# EasyEDA schematic SCH_ZIF CONNECTOR_2023-04-06.json

## Sheets
1 Sheet_1: TITLE: Sheet_1; REV: 1.0; Date: 2023-02-28; Sheet: 1/1; Drawn By: venkatakrishnanr; Company: Your Company
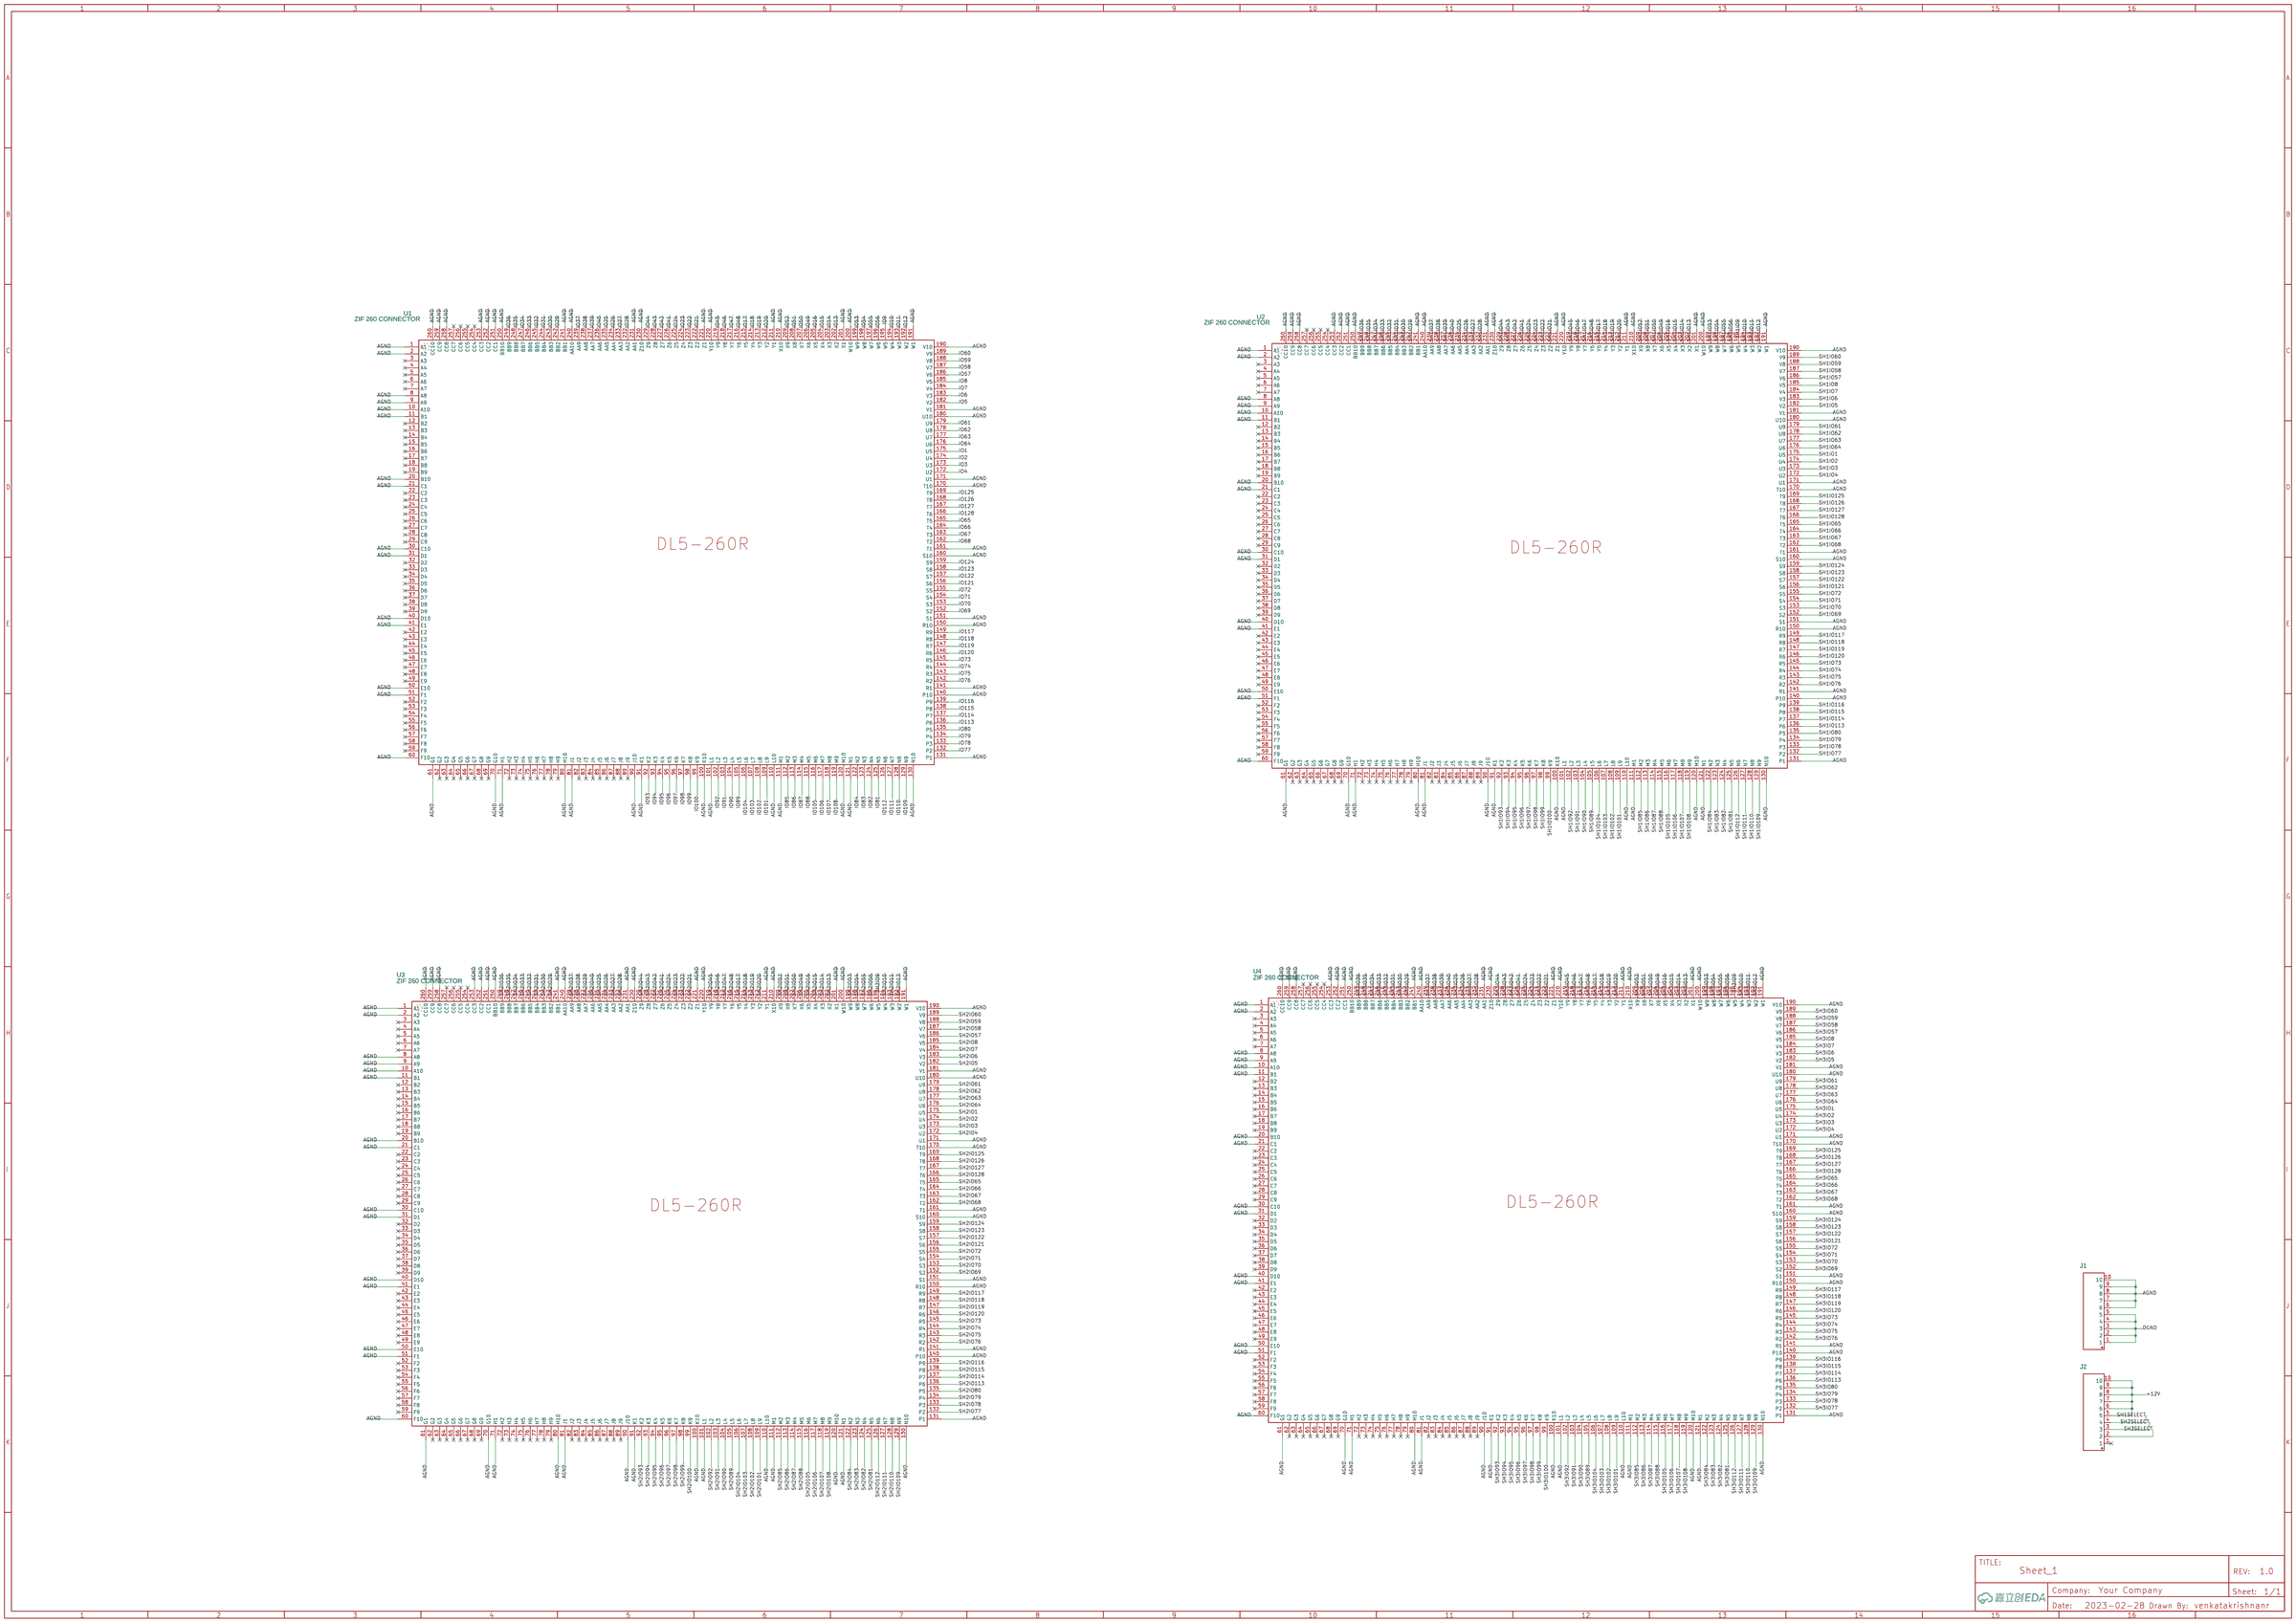
[diagram p0: Sheet_1]
2 Sheet_2: TITLE: Sheet_2; Date: 2023-03-07
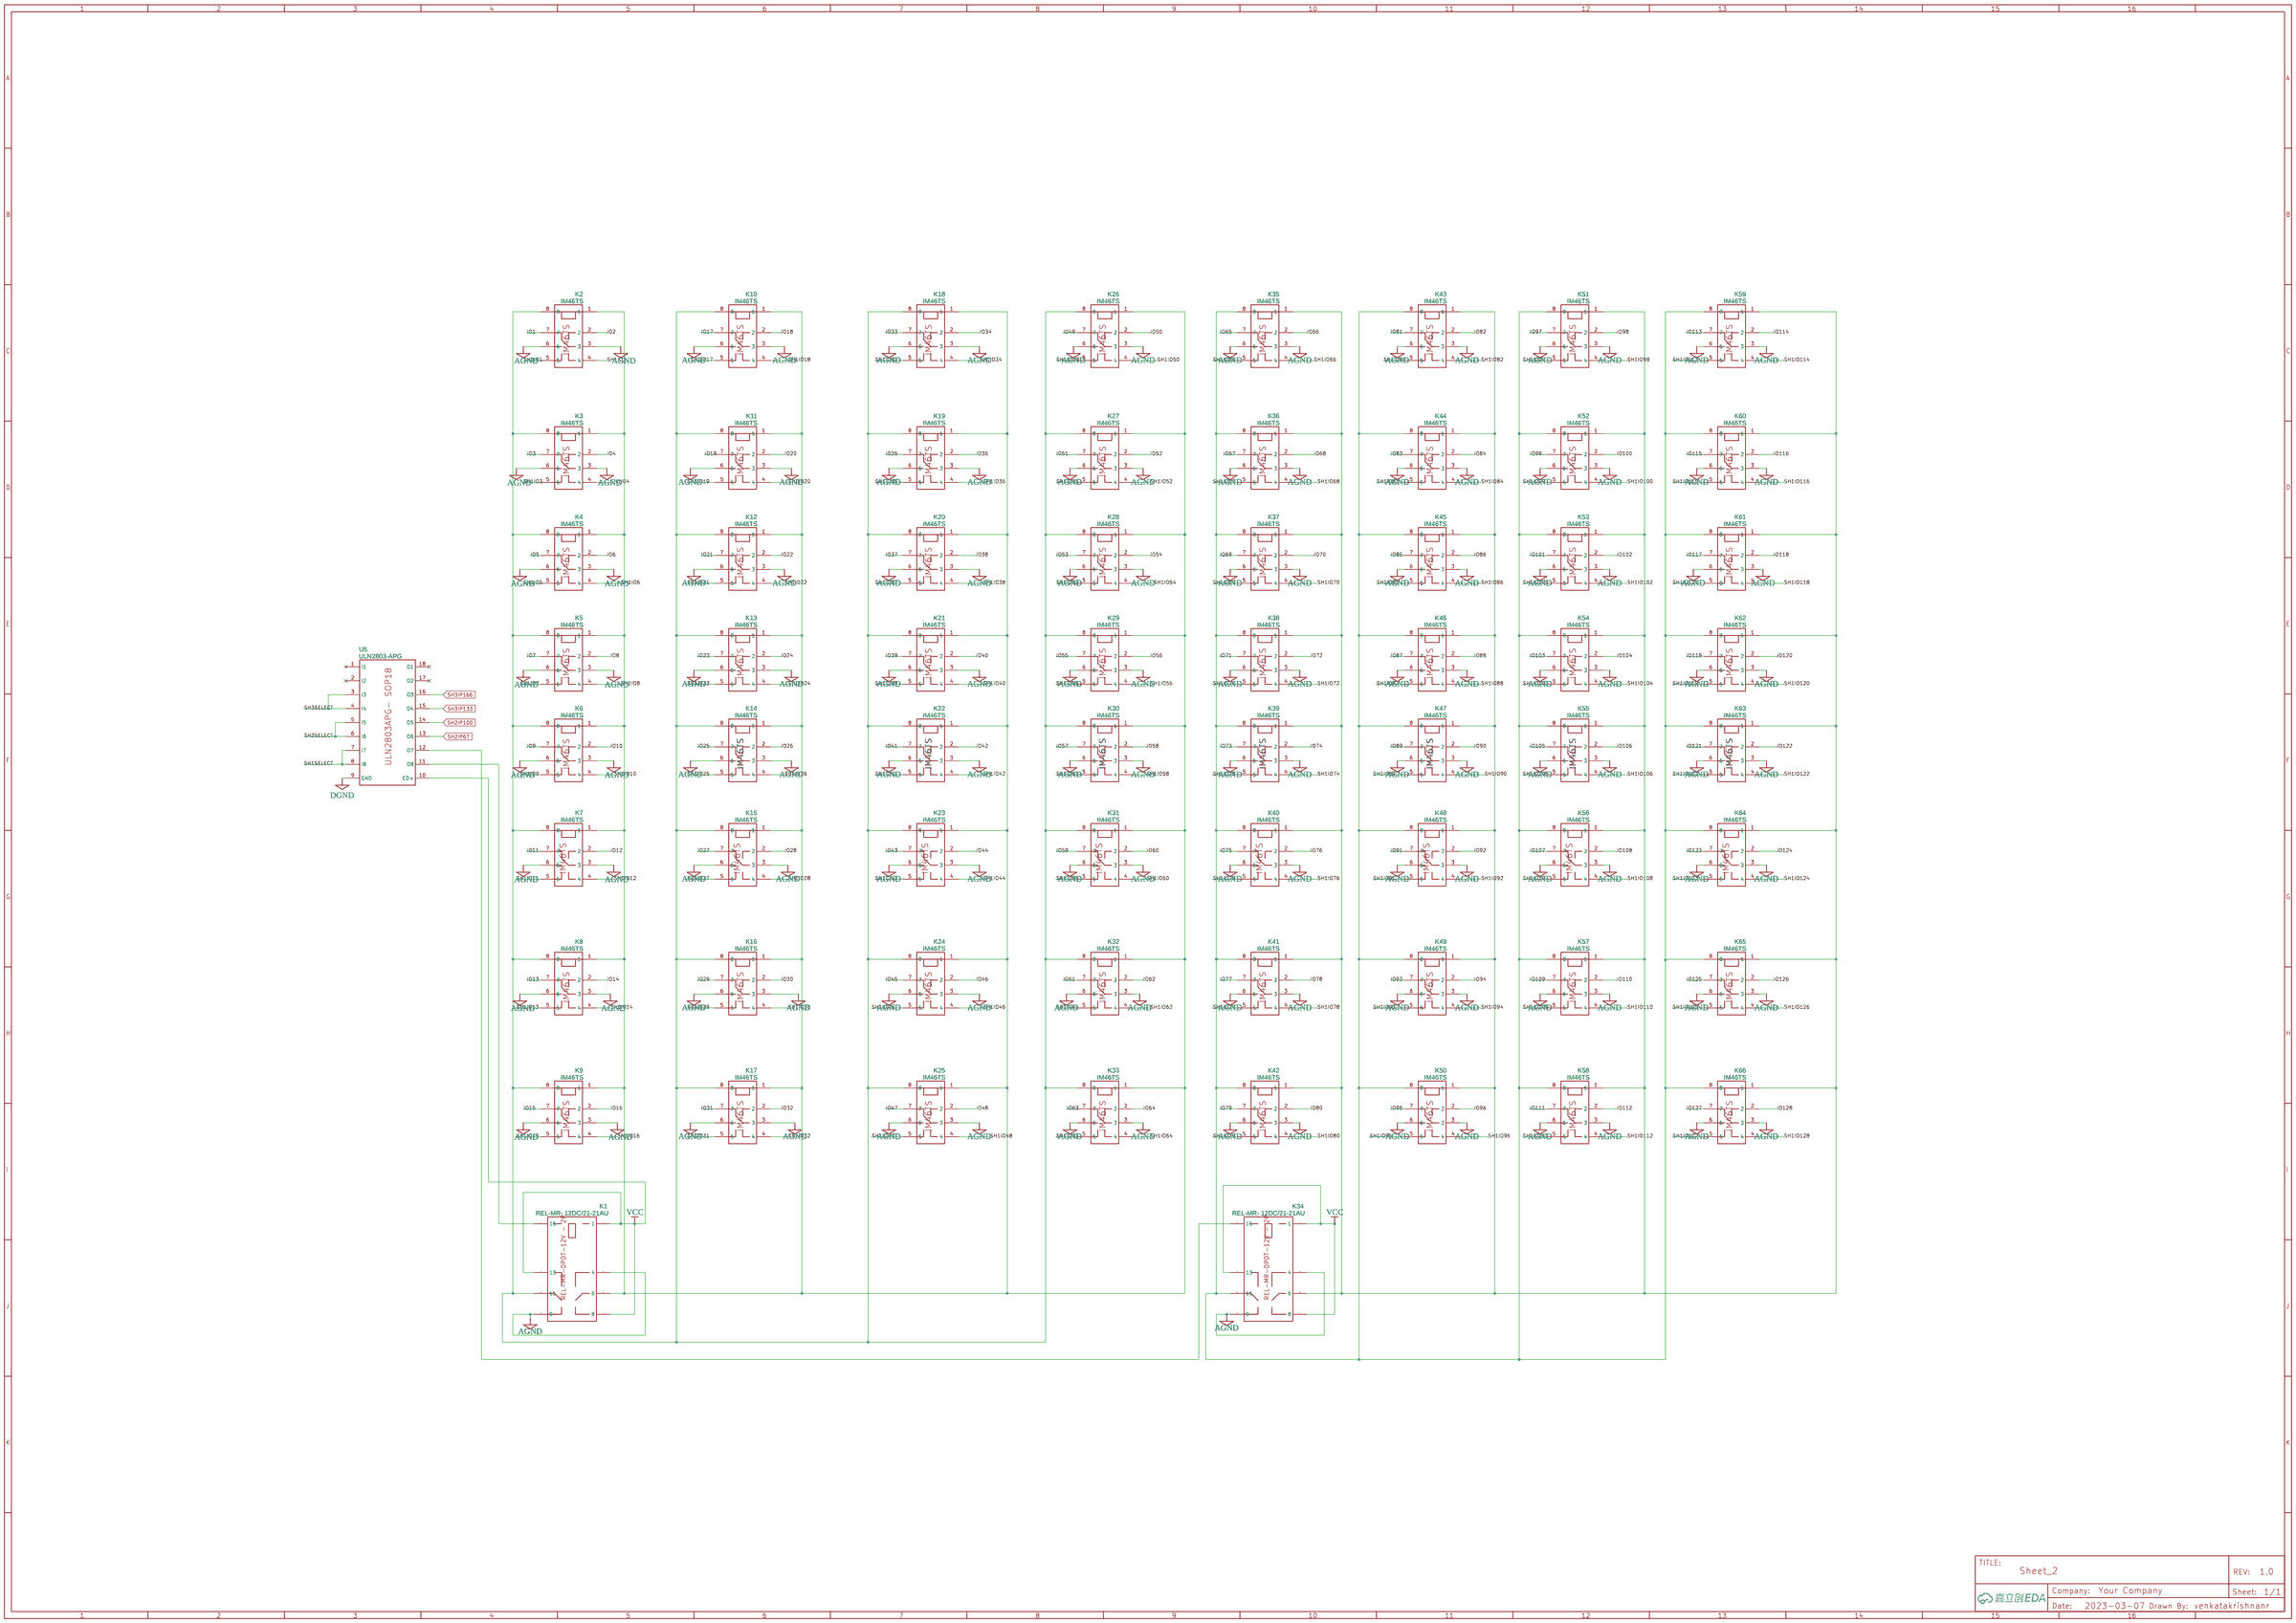
[diagram p1: Sheet_2]
3 Sheet_3: TITLE: Sheet_3; Date: 2023-03-08
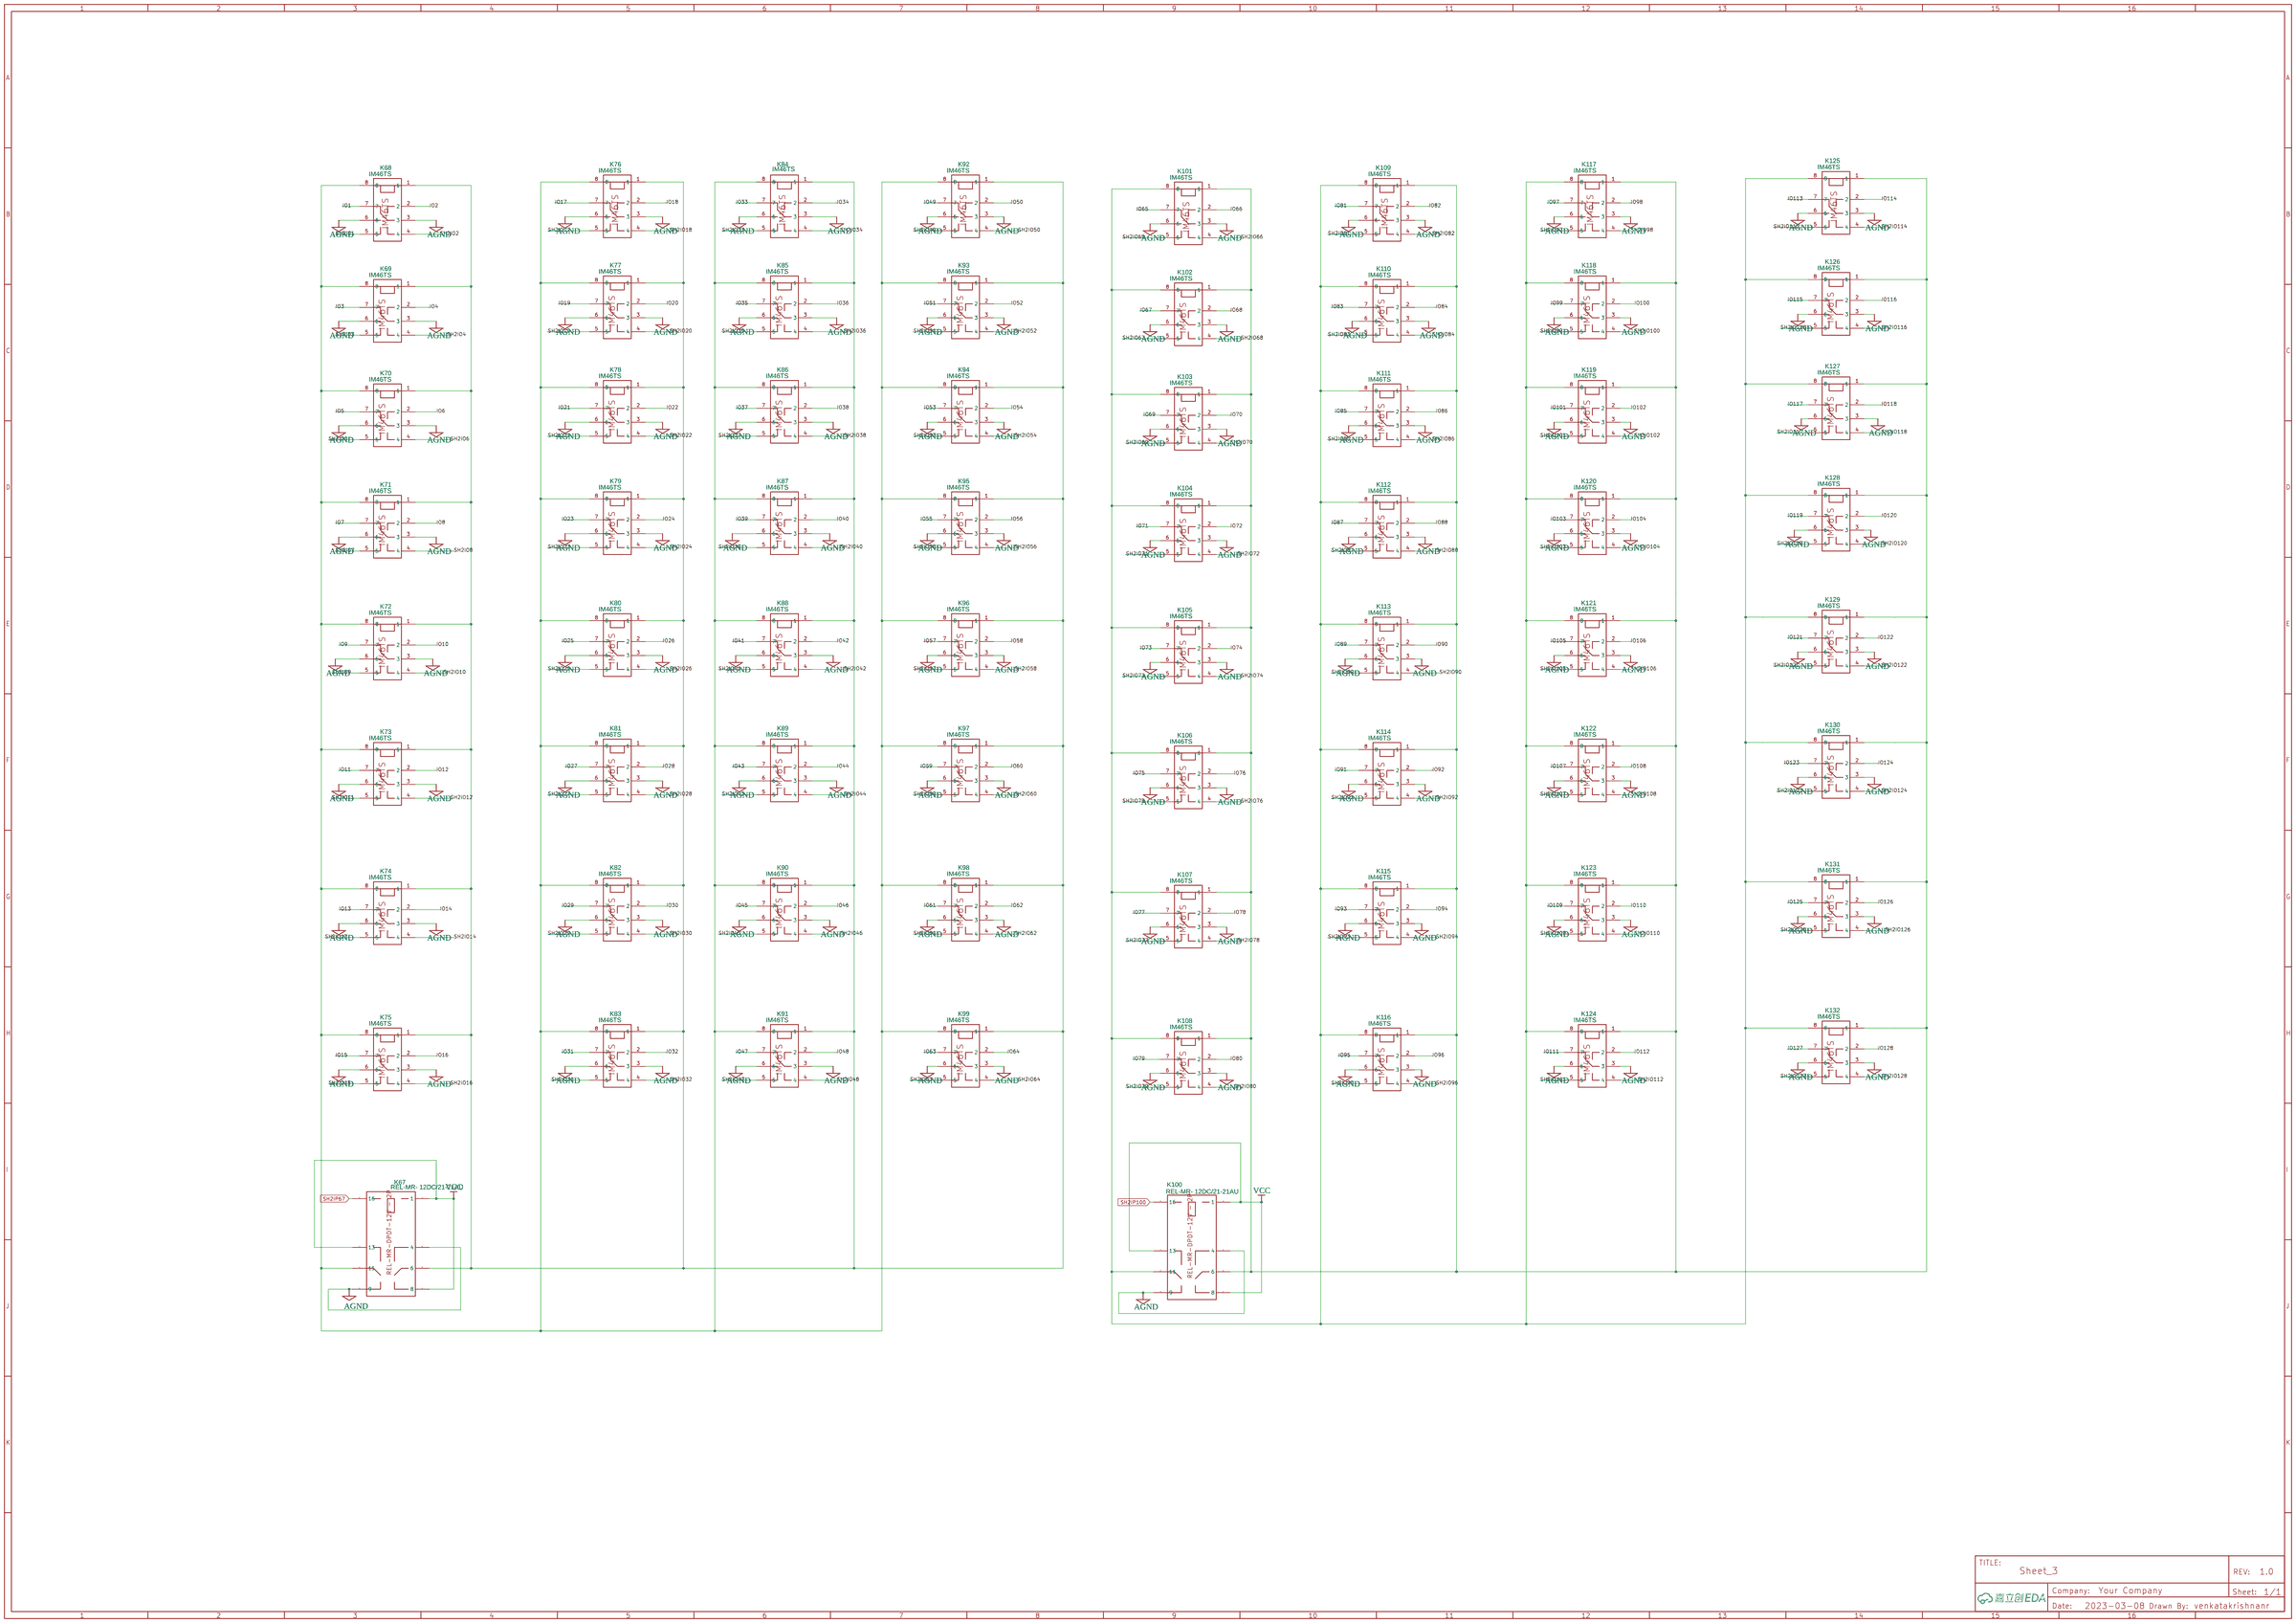
[diagram p2: Sheet_3]
4 Sheet_4: TITLE: Sheet_4; Date: 2023-03-09
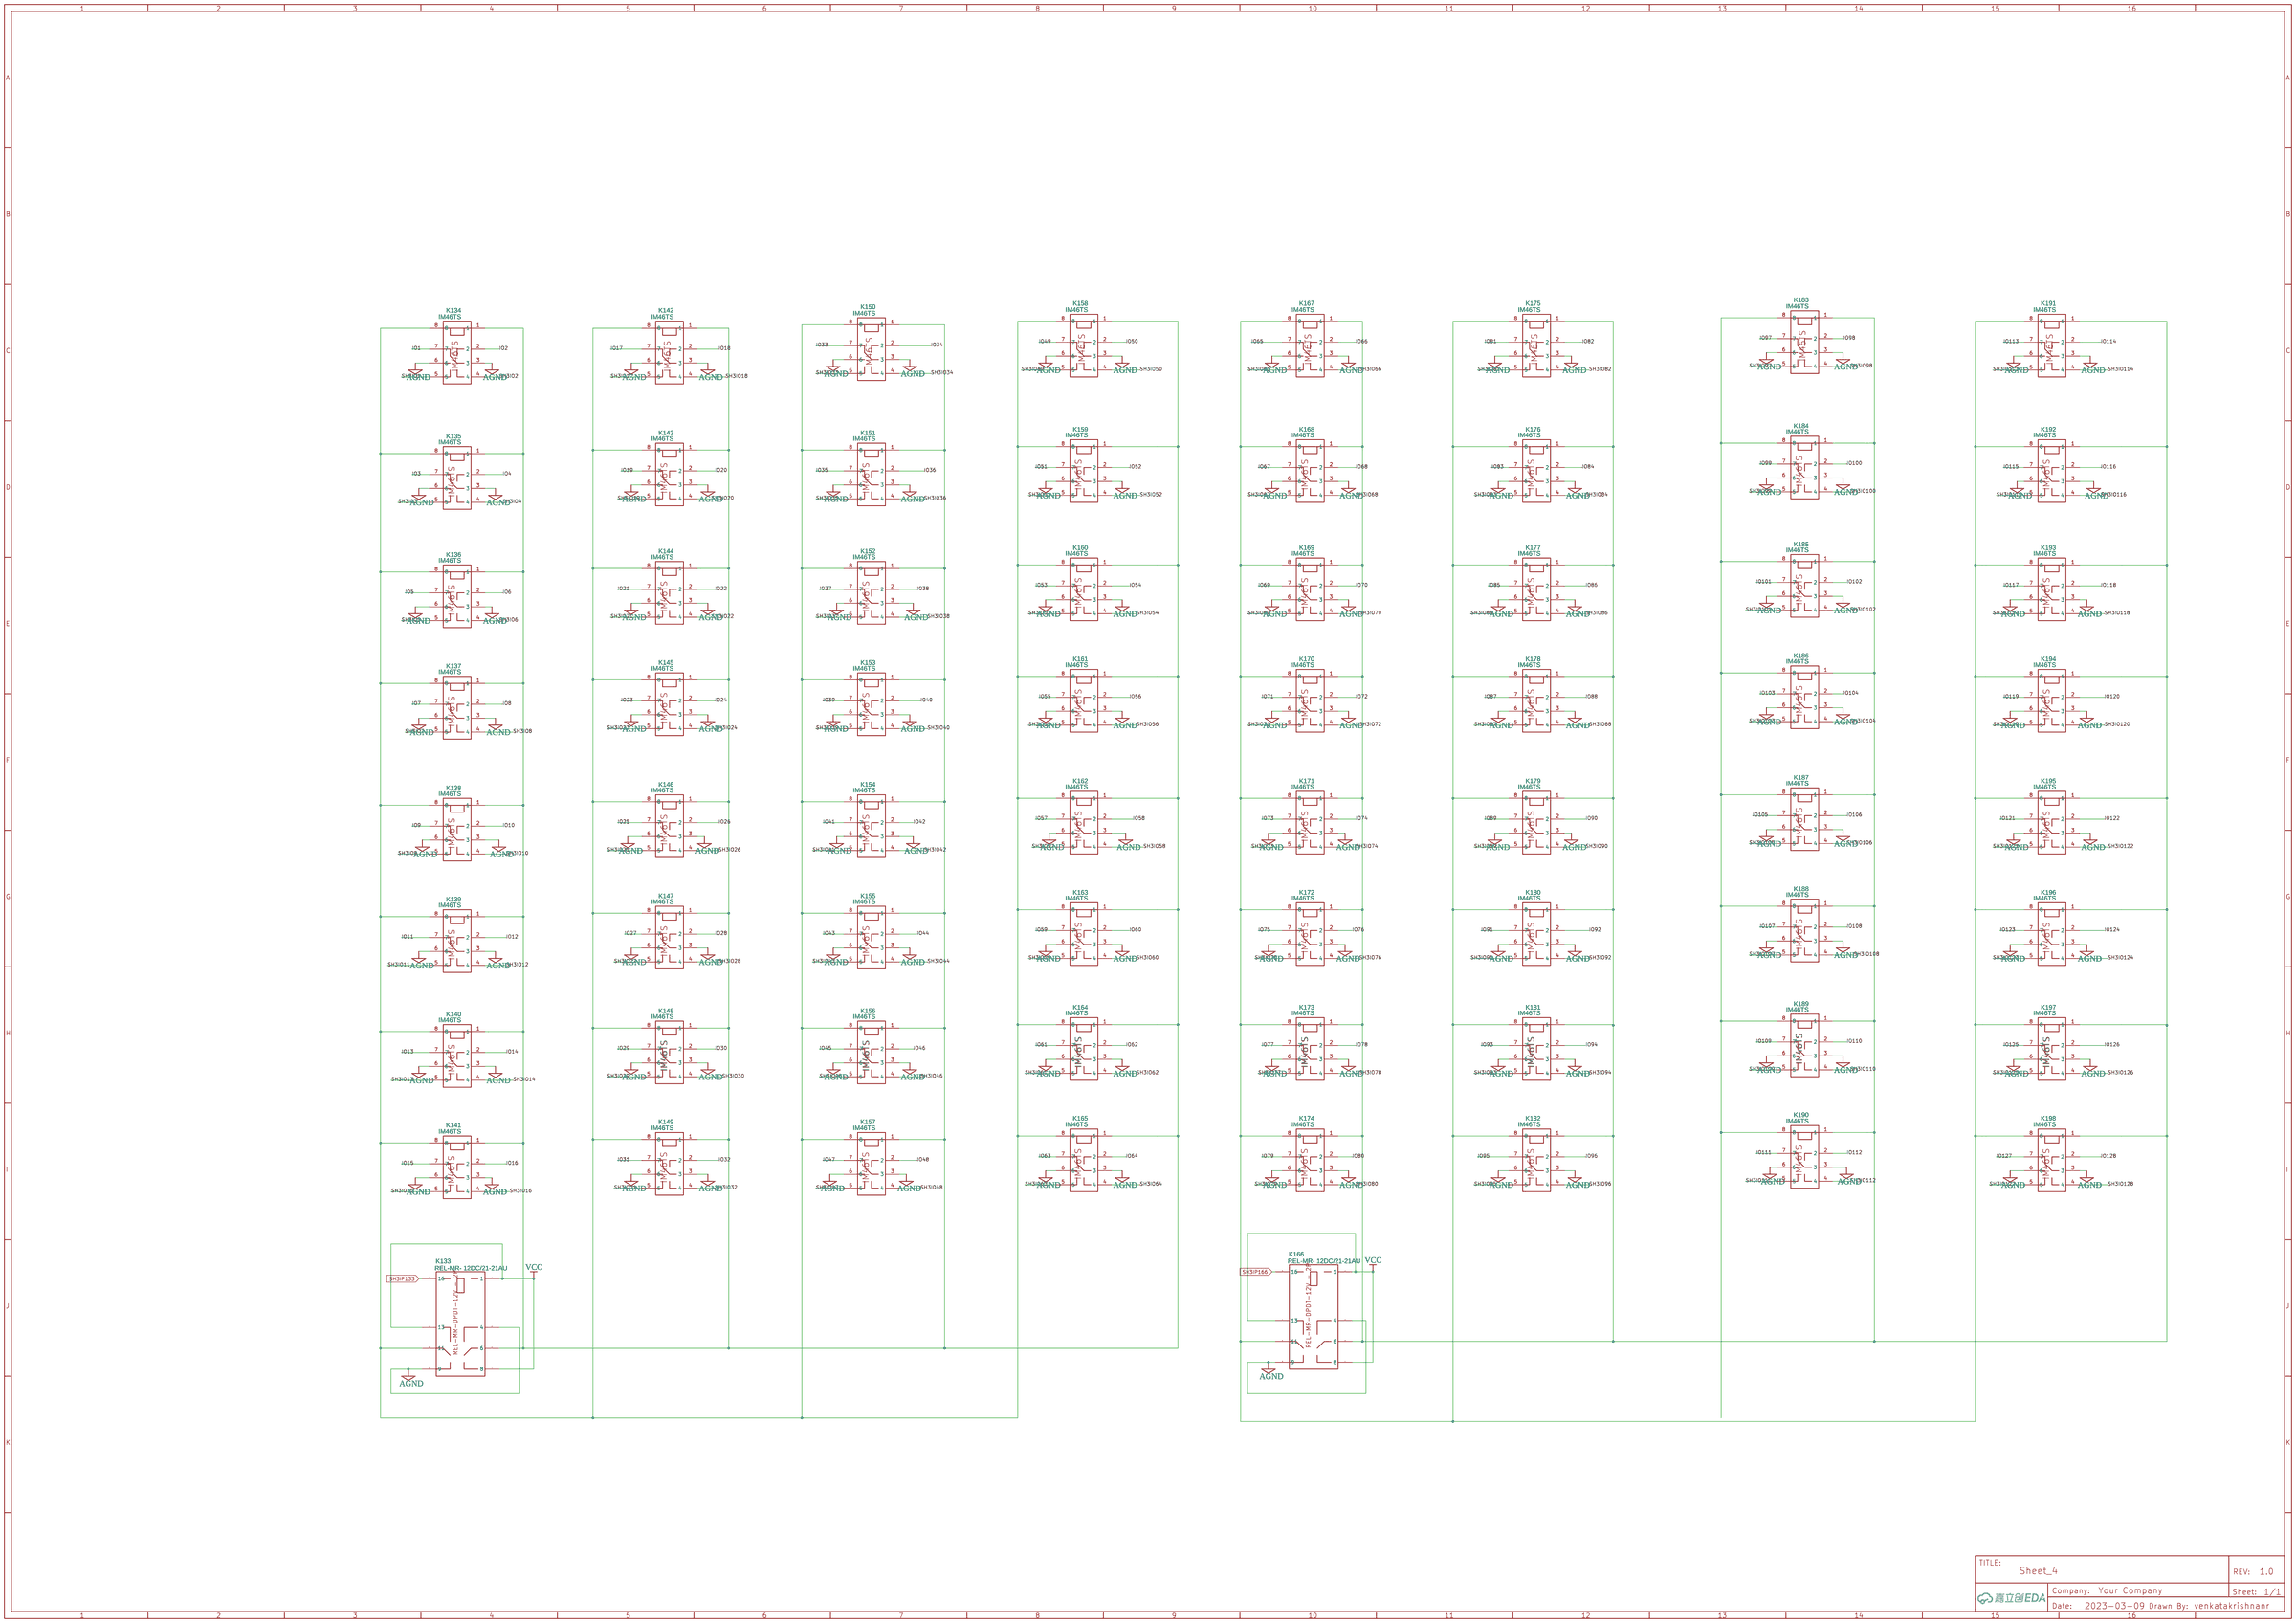
[diagram p3: Sheet_4]

## Parts
sheet Sheet_1
J1  210S-1*10P L=11.6MMGold-plated black  [HDR-TH_10P-P2.54-V-M-1]
J2  210S-1*10P L=11.6MMGold-plated black  [HDR-TH_10P-P2.54-V-M-1]
U1  ZIF 260 CONNECTOR  [DL5-260R]
U2  ZIF 260 CONNECTOR  [DL5-260R]
U3  ZIF 260 CONNECTOR  [DL5-260R]
U4  ZIF 260 CONNECTOR  [DL5-260R]
sheet Sheet_2
K1  REL-MR- 12DC/21-21AU  [REL_MRDPDT_12V_FP]
K2  IM46TS  [SIP_01X08_D0.7MM]
K3  IM46TS  [SIP_01X08_D0.7MM]
K4  IM46TS  [SIP_01X08_D0.7MM]
K5  IM46TS  [SIP_01X08_D0.7MM]
K6  IM46TS  [SIP_01X08_D0.7MM]
K7  IM46TS  [SIP_01X08_D0.7MM]
K8  IM46TS  [SIP_01X08_D0.7MM]
K9  IM46TS  [SIP_01X08_D0.7MM]
K10  IM46TS  [SIP_01X08_D0.7MM]
K11  IM46TS  [SIP_01X08_D0.7MM]
K12  IM46TS  [SIP_01X08_D0.7MM]
K13  IM46TS  [SIP_01X08_D0.7MM]
K14  IM46TS  [SIP_01X08_D0.7MM]
K15  IM46TS  [SIP_01X08_D0.7MM]
K16  IM46TS  [SIP_01X08_D0.7MM]
K17  IM46TS  [SIP_01X08_D0.7MM]
K18  IM46TS  [SIP_01X08_D0.7MM]
K19  IM46TS  [SIP_01X08_D0.7MM]
K20  IM46TS  [SIP_01X08_D0.7MM]
K21  IM46TS  [SIP_01X08_D0.7MM]
K22  IM46TS  [SIP_01X08_D0.7MM]
K23  IM46TS  [SIP_01X08_D0.7MM]
K24  IM46TS  [SIP_01X08_D0.7MM]
K25  IM46TS  [SIP_01X08_D0.7MM]
K26  IM46TS  [SIP_01X08_D0.7MM]
K27  IM46TS  [SIP_01X08_D0.7MM]
K28  IM46TS  [SIP_01X08_D0.7MM]
K29  IM46TS  [SIP_01X08_D0.7MM]
K30  IM46TS  [SIP_01X08_D0.7MM]
K31  IM46TS  [SIP_01X08_D0.7MM]
K32  IM46TS  [SIP_01X08_D0.7MM]
K33  IM46TS  [SIP_01X08_D0.7MM]
K34  REL-MR- 12DC/21-21AU  [REL_MRDPDT_12V_FP]
K35  IM46TS  [SIP_01X08_D0.7MM]
K36  IM46TS  [SIP_01X08_D0.7MM]
K37  IM46TS  [SIP_01X08_D0.7MM]
K38  IM46TS  [SIP_01X08_D0.7MM]
K39  IM46TS  [SIP_01X08_D0.7MM]
K40  IM46TS  [SIP_01X08_D0.7MM]
K41  IM46TS  [SIP_01X08_D0.7MM]
K42  IM46TS  [SIP_01X08_D0.7MM]
K43  IM46TS  [SIP_01X08_D0.7MM]
K44  IM46TS  [SIP_01X08_D0.7MM]
K45  IM46TS  [SIP_01X08_D0.7MM]
K46  IM46TS  [SIP_01X08_D0.7MM]
K47  IM46TS  [SIP_01X08_D0.7MM]
K48  IM46TS  [SIP_01X08_D0.7MM]
K49  IM46TS  [SIP_01X08_D0.7MM]
K50  IM46TS  [SIP_01X08_D0.7MM]
K51  IM46TS  [SIP_01X08_D0.7MM]
K52  IM46TS  [SIP_01X08_D0.7MM]
K53  IM46TS  [SIP_01X08_D0.7MM]
K54  IM46TS  [SIP_01X08_D0.7MM]
K55  IM46TS  [SIP_01X08_D0.7MM]
K56  IM46TS  [SIP_01X08_D0.7MM]
K57  IM46TS  [SIP_01X08_D0.7MM]
K58  IM46TS  [SIP_01X08_D0.7MM]
K59  IM46TS  [SIP_01X08_D0.7MM]
K60  IM46TS  [SIP_01X08_D0.7MM]
K61  IM46TS  [SIP_01X08_D0.7MM]
K62  IM46TS  [SIP_01X08_D0.7MM]
K63  IM46TS  [SIP_01X08_D0.7MM]
K64  IM46TS  [SIP_01X08_D0.7MM]
K65  IM46TS  [SIP_01X08_D0.7MM]
K66  IM46TS  [SIP_01X08_D0.7MM]
U5  ULN2803-APG  [ULN2803APG_SOP18P]
sheet Sheet_3
K67  REL-MR- 12DC/21-21AU  [REL_MRDPDT_12V_FP]
K68  IM46TS  [SIP_01X08_D0.7MM]
K69  IM46TS  [SIP_01X08_D0.7MM]
K70  IM46TS  [SIP_01X08_D0.7MM]
K71  IM46TS  [SIP_01X08_D0.7MM]
K72  IM46TS  [SIP_01X08_D0.7MM]
K73  IM46TS  [SIP_01X08_D0.7MM]
K74  IM46TS  [SIP_01X08_D0.7MM]
K75  IM46TS  [SIP_01X08_D0.7MM]
K76  IM46TS  [SIP_01X08_D0.7MM]
K77  IM46TS  [SIP_01X08_D0.7MM]
K78  IM46TS  [SIP_01X08_D0.7MM]
K79  IM46TS  [SIP_01X08_D0.7MM]
K80  IM46TS  [SIP_01X08_D0.7MM]
K81  IM46TS  [SIP_01X08_D0.7MM]
K82  IM46TS  [SIP_01X08_D0.7MM]
K83  IM46TS  [SIP_01X08_D0.7MM]
K84  IM46TS  [SIP_01X08_D0.7MM]
K85  IM46TS  [SIP_01X08_D0.7MM]
K86  IM46TS  [SIP_01X08_D0.7MM]
K87  IM46TS  [SIP_01X08_D0.7MM]
K88  IM46TS  [SIP_01X08_D0.7MM]
K89  IM46TS  [SIP_01X08_D0.7MM]
K90  IM46TS  [SIP_01X08_D0.7MM]
K91  IM46TS  [SIP_01X08_D0.7MM]
K92  IM46TS  [SIP_01X08_D0.7MM]
K93  IM46TS  [SIP_01X08_D0.7MM]
K94  IM46TS  [SIP_01X08_D0.7MM]
K95  IM46TS  [SIP_01X08_D0.7MM]
K96  IM46TS  [SIP_01X08_D0.7MM]
K97  IM46TS  [SIP_01X08_D0.7MM]
K98  IM46TS  [SIP_01X08_D0.7MM]
K99  IM46TS  [SIP_01X08_D0.7MM]
K100  REL-MR- 12DC/21-21AU  [REL_MRDPDT_12V_FP]
K101  IM46TS  [SIP_01X08_D0.7MM]
K102  IM46TS  [SIP_01X08_D0.7MM]
K103  IM46TS  [SIP_01X08_D0.7MM]
K104  IM46TS  [SIP_01X08_D0.7MM]
K105  IM46TS  [SIP_01X08_D0.7MM]
K106  IM46TS  [SIP_01X08_D0.7MM]
K107  IM46TS  [SIP_01X08_D0.7MM]
K108  IM46TS  [SIP_01X08_D0.7MM]
K109  IM46TS  [SIP_01X08_D0.7MM]
K110  IM46TS  [SIP_01X08_D0.7MM]
K111  IM46TS  [SIP_01X08_D0.7MM]
K112  IM46TS  [SIP_01X08_D0.7MM]
K113  IM46TS  [SIP_01X08_D0.7MM]
K114  IM46TS  [SIP_01X08_D0.7MM]
K115  IM46TS  [SIP_01X08_D0.7MM]
K116  IM46TS  [SIP_01X08_D0.7MM]
K117  IM46TS  [SIP_01X08_D0.7MM]
K118  IM46TS  [SIP_01X08_D0.7MM]
K119  IM46TS  [SIP_01X08_D0.7MM]
K120  IM46TS  [SIP_01X08_D0.7MM]
K121  IM46TS  [SIP_01X08_D0.7MM]
K122  IM46TS  [SIP_01X08_D0.7MM]
K123  IM46TS  [SIP_01X08_D0.7MM]
K124  IM46TS  [SIP_01X08_D0.7MM]
K125  IM46TS  [SIP_01X08_D0.7MM]
K126  IM46TS  [SIP_01X08_D0.7MM]
K127  IM46TS  [SIP_01X08_D0.7MM]
K128  IM46TS  [SIP_01X08_D0.7MM]
K129  IM46TS  [SIP_01X08_D0.7MM]
K130  IM46TS  [SIP_01X08_D0.7MM]
K131  IM46TS  [SIP_01X08_D0.7MM]
K132  IM46TS  [SIP_01X08_D0.7MM]
sheet Sheet_4
K133  REL-MR- 12DC/21-21AU  [REL_MRDPDT_12V_FP]
K134  IM46TS  [SIP_01X08_D0.7MM]
K135  IM46TS  [SIP_01X08_D0.7MM]
K136  IM46TS  [SIP_01X08_D0.7MM]
K137  IM46TS  [SIP_01X08_D0.7MM]
K138  IM46TS  [SIP_01X08_D0.7MM]
K139  IM46TS  [SIP_01X08_D0.7MM]
K140  IM46TS  [SIP_01X08_D0.7MM]
K141  IM46TS  [SIP_01X08_D0.7MM]
K142  IM46TS  [SIP_01X08_D0.7MM]
K143  IM46TS  [SIP_01X08_D0.7MM]
K144  IM46TS  [SIP_01X08_D0.7MM]
K145  IM46TS  [SIP_01X08_D0.7MM]
K146  IM46TS  [SIP_01X08_D0.7MM]
K147  IM46TS  [SIP_01X08_D0.7MM]
K148  IM46TS  [SIP_01X08_D0.7MM]
K149  IM46TS  [SIP_01X08_D0.7MM]
K150  IM46TS  [SIP_01X08_D0.7MM]
K151  IM46TS  [SIP_01X08_D0.7MM]
K152  IM46TS  [SIP_01X08_D0.7MM]
K153  IM46TS  [SIP_01X08_D0.7MM]
K154  IM46TS  [SIP_01X08_D0.7MM]
K155  IM46TS  [SIP_01X08_D0.7MM]
K156  IM46TS  [SIP_01X08_D0.7MM]
K157  IM46TS  [SIP_01X08_D0.7MM]
K158  IM46TS  [SIP_01X08_D0.7MM]
K159  IM46TS  [SIP_01X08_D0.7MM]
K160  IM46TS  [SIP_01X08_D0.7MM]
K161  IM46TS  [SIP_01X08_D0.7MM]
K162  IM46TS  [SIP_01X08_D0.7MM]
K163  IM46TS  [SIP_01X08_D0.7MM]
K164  IM46TS  [SIP_01X08_D0.7MM]
K165  IM46TS  [SIP_01X08_D0.7MM]
K166  REL-MR- 12DC/21-21AU  [REL_MRDPDT_12V_FP]
K167  IM46TS  [SIP_01X08_D0.7MM]
K168  IM46TS  [SIP_01X08_D0.7MM]
K169  IM46TS  [SIP_01X08_D0.7MM]
K170  IM46TS  [SIP_01X08_D0.7MM]
K171  IM46TS  [SIP_01X08_D0.7MM]
K172  IM46TS  [SIP_01X08_D0.7MM]
K173  IM46TS  [SIP_01X08_D0.7MM]
K174  IM46TS  [SIP_01X08_D0.7MM]
K175  IM46TS  [SIP_01X08_D0.7MM]
K176  IM46TS  [SIP_01X08_D0.7MM]
K177  IM46TS  [SIP_01X08_D0.7MM]
K178  IM46TS  [SIP_01X08_D0.7MM]
K179  IM46TS  [SIP_01X08_D0.7MM]
K180  IM46TS  [SIP_01X08_D0.7MM]
K181  IM46TS  [SIP_01X08_D0.7MM]
K182  IM46TS  [SIP_01X08_D0.7MM]
K183  IM46TS  [SIP_01X08_D0.7MM]
K184  IM46TS  [SIP_01X08_D0.7MM]
K185  IM46TS  [SIP_01X08_D0.7MM]
K186  IM46TS  [SIP_01X08_D0.7MM]
K187  IM46TS  [SIP_01X08_D0.7MM]
K188  IM46TS  [SIP_01X08_D0.7MM]
K189  IM46TS  [SIP_01X08_D0.7MM]
K190  IM46TS  [SIP_01X08_D0.7MM]
K191  IM46TS  [SIP_01X08_D0.7MM]
K192  IM46TS  [SIP_01X08_D0.7MM]
K193  IM46TS  [SIP_01X08_D0.7MM]
K194  IM46TS  [SIP_01X08_D0.7MM]
K195  IM46TS  [SIP_01X08_D0.7MM]
K196  IM46TS  [SIP_01X08_D0.7MM]
K197  IM46TS  [SIP_01X08_D0.7MM]
K198  IM46TS  [SIP_01X08_D0.7MM]

## Library data of the parts
J1 J2 = 210S-1*10P L=11.6MMGold-plated black: Supplier: LCSC; Manufacturer: Ckmtw(灿科盟); Manufacturer Part: B-2100S10P-A110; Contributor: LCSC; Supplier Part: C124372; JLCPCB Part Class: Extended Part
U1-U4 = ZIF 260 CONNECTOR: Manufacturer: ITT Cannon, LLC; Manufacturer Part: DL5-260RW6B; Supplier: Digi-Key; Supplier Part: 1003-1696-ND; link: https://media.digikey.com/pdf/Data%20Sheets/ITT%20Cannon/DL_Series_ZIF_Con_Cat.pdf; Contributor: venkatakrishnanr
K1 K34 K67 K100 K133 K166 = REL-MR- 12DC/21-21AU: Manufacturer: Phoenix Contact; Manufacturer Part: 2961299; Supplier: Digi-Key; Supplier Part: 277-7568-ND; link: https://www.digikey.in/en/products/detail/phoenix-contact/2961299/3596906?s=N4IgTCBcDaIEoFEAyBaAsnFACAjGAIgMID0YOKZAggKogC6AvkA; Contributor: venkatakrishnanr
K2-K33 K35-K66 K68-K99 K101-K132 K134-K165 K167-K198 = IM46TS: Manufacturer: TE Connectivity Potter & Brumfield Relays; Manufacturer Part: 6-1462037-6; Supplier: Digi-Key; Supplier Part: PB2085-ND; link: https://www.digikey.in/en/products/detail/te-connectivity-potter-brumfield-relays/6-1462037-6/2398972?s=N4IgTCBcDaIJYFsAsA2ALgZxAXQL5A; Contributor: venkatakrishnanr
U5 = ULN2803-APG: Manufacturer: Toshiba Semiconductor and Storage; Manufacturer Part: ULN2803APG,CN; Supplier: Digi-Key; Supplier Part: ULN2803APGCN-ND; link: https://www.digikey.in/en/products/detail/toshiba-semiconductor-and-storage/ULN2803APG-CN/856431?s=N4IgTCBcDaIKoBkByYAcAGAzAQQAoHEACEAXQF8g; Contributor: venkatakrishnanr

## Nets
+12V: J2.5 J2.6 J2.7 J2.8 J2.9 J2.10
AGND: J1.6 J1.7 J1.8 J1.9 J1.10 K1.2(4) K1.5(9) K2.3 K2.6 K3.3 K3.6 K4.3 K4.6 K5.3 K5.6 K6.3 K6.6 K7.3 K7.6 K8.3 K8.6 K9.3 K9.6 K10.3 K10.6 K11.3 K11.6 K12.3 K12.6 K13.3 K13.6 K14.3 K14.6 K15.3 K15.6 K16.3 K16.6 K17.3 K17.6 K18.3 K18.6 K19.3 K19.6 K20.3 K20.6 K21.3 K21.6 K22.3 K22.6 K23.3 K23.6 K24.3 K24.6 K25.3 K25.6 K26.3 K26.6 K27.3 K27.6 K28.3 K28.6 K29.3 K29.6 K30.3 K30.6 K31.3 K31.6 K32.3 K32.6 K33.3 K33.6 K34.2(4) K34.5(9) K35.3 K35.6 K36.3 K36.6 K37.3 K37.6 K38.3 K38.6 K39.3 K39.6 K40.3 K40.6 K41.3 K41.6 K42.3 K42.6 K43.3 K43.6 K44.3 K44.6 K45.3 K45.6 K46.3 K46.6 K47.3 K47.6 K48.3 K48.6 K49.3 K49.6 K50.3 K50.6 K51.3 K51.6 K52.3 K52.6 K53.3 K53.6 K54.3 K54.6 K55.3 K55.6 K56.3 K56.6 K57.3 K57.6 K58.3 K58.6 K59.3 K59.6 K60.3 K60.6 K61.3 K61.6 K62.3 K62.6 K63.3 K63.6 K64.3 K64.6 K65.3 K65.6 K66.3 K66.6 K67.2(4) K67.5(9) K68.3 K68.6 K69.3 K69.6 K70.3 K70.6 K71.3 K71.6 K72.3 K72.6 K73.3 K73.6 K74.3 K74.6 K75.3 K75.6 K76.3 K76.6 K77.3 K77.6 K78.3 K78.6 K79.3 K79.6 K80.3 K80.6 K81.3 K81.6 K82.3 K82.6 K83.3 K83.6 K84.3 K84.6 K85.3 K85.6 K86.3 K86.6 K87.3 K87.6 K88.3 K88.6 K89.3 K89.6 K90.3 K90.6 K91.3 K91.6 K92.3 K92.6 K93.3 K93.6 K94.3 K94.6 K95.3 K95.6 K96.3 K96.6 K97.3 K97.6 K98.3 K98.6 K99.3 K99.6 K100.2(4) K100.5(9) K101.3 K101.6 K102.3 K102.6 K103.3 K103.6 K104.3 K104.6 K105.3 K105.6 K106.3 K106.6 K107.3 K107.6 K108.3 K108.6 K109.3 K109.6 K110.3 K110.6 K111.3 K111.6 K112.3 K112.6 K113.3 K113.6 K114.3 K114.6 K115.3 K115.6 K116.3 K116.6 K117.3 K117.6 K118.3 K118.6 K119.3 K119.6 K120.3 K120.6 K121.3 K121.6 K122.3 K122.6 K123.3 K123.6 K124.3 K124.6 K125.3 K125.6 K126.3 K126.6 K127.3 K127.6 K128.3 K128.6 K129.3 K129.6 K130.3 K130.6 K131.3 K131.6 K132.3 K132.6 K133.2(4) K133.5(9) K134.3 K134.6 K135.3 K135.6 K136.3 K136.6 K137.3 K137.6 K138.3 K138.6 K139.3 K139.6 K140.3 K140.6 K141.3 K141.6 K142.3 K142.6 K143.3 K143.6 K144.3 K144.6 K145.3 K145.6 K146.3 K146.6 K147.3 K147.6 K148.3 K148.6 K149.3 K149.6 K150.3 K150.6 K151.3 K151.6 K152.3 K152.6 K153.3 K153.6 K154.3 K154.6 K155.3 K155.6 K156.3 K156.6 K157.3 K157.6 K158.3 K158.6 K159.3 K159.6 K160.3 K160.6 K161.3 K161.6 K162.3 K162.6 K163.3 K163.6 K164.3 K164.6 K165.3 K165.6 K166.2(4) K166.5(9) K167.3 K167.6 K168.3 K168.6 K169.3 K169.6 K170.3 K170.6 K171.3 K171.6 K172.3 K172.6 K173.3 K173.6 K174.3 K174.6 K175.3 K175.6 K176.3 K176.6 K177.3 K177.6 K178.3 K178.6 K179.3 K179.6 K180.3 K180.6 K181.3 K181.6 K182.3 K182.6 K183.3 K183.6 K184.3 K184.6 K185.3 K185.6 K186.3 K186.6 K187.3 K187.6 K188.3 K188.6 K189.3 K189.6 K190.3 K190.6 K191.3 K191.6 K192.3 K192.6 K193.3 K193.6 K194.3 K194.6 K195.3 K195.6 K196.3 K196.6 K197.3 K197.6 K198.3 K198.6 U1.1(A1) U1.2(A2) U1.8(A8) U1.9(A9) U1.10(A10) U1.11(B1) U1.20(B10) U1.21(C1) U1.30(C10) U1.31(D1) U1.40(D10) U1.41(E1) U1.50(E10) U1.51(F1) U1.60(F10) U1.61(G1) U1.70(G10) U1.71(H1) U1.80(H10) U1.81(J1) U1.90(J10) U1.91(K1) U1.100(K10) U1.101(L1) U1.110(L10) U1.111(M1) U1.120(M10) U1.121(N1) U1.130(N10) U1.131(P1) U1.140(P10) U1.141(R1) U1.150(R10) U1.151(S1) U1.160(S10) U1.161(T1) U1.170(T10) U1.171(U1) U1.180(U10) U1.181(V1) U1.190(V10) U1.191(W1) U1.200(W10) U1.201(X1) U1.210(X10) U1.211(Y1) U1.220(Y10) U1.221(Z1) U1.230(Z10) U1.231(AA1) U1.240(AA10) U1.241(BB1) U1.250(BB10) U1.251(CC1) U1.252(CC2) U1.253(CC3) U1.258(CC8) U1.259(CC9) U1.260(CC10) U2.1(A1) U2.2(A2) U2.8(A8) U2.9(A9) U2.10(A10) U2.11(B1) U2.20(B10) U2.21(C1) U2.30(C10) U2.31(D1) U2.40(D10) U2.41(E1) U2.50(E10) U2.51(F1) U2.60(F10) U2.61(G1) U2.70(G10) U2.71(H1) U2.80(H10) U2.81(J1) U2.90(J10) U2.91(K1) U2.100(K10) U2.101(L1) U2.110(L10) U2.111(M1) U2.120(M10) U2.121(N1) U2.130(N10) U2.131(P1) U2.140(P10) U2.141(R1) U2.150(R10) U2.151(S1) U2.160(S10) U2.161(T1) U2.170(T10) U2.171(U1) U2.180(U10) U2.181(V1) U2.190(V10) U2.191(W1) U2.200(W10) U2.201(X1) U2.210(X10) U2.211(Y1) U2.220(Y10) U2.221(Z1) U2.230(Z10) U2.231(AA1) U2.240(AA10) U2.241(BB1) U2.250(BB10) U2.251(CC1) U2.252(CC2) U2.253(CC3) U2.258(CC8) U2.259(CC9) U2.260(CC10) U3.1(A1) U3.2(A2) U3.8(A8) U3.9(A9) U3.10(A10) U3.11(B1) U3.20(B10) U3.21(C1) U3.30(C10) U3.31(D1) U3.40(D10) U3.41(E1) U3.50(E10) U3.51(F1) U3.60(F10) U3.61(G1) U3.70(G10) U3.71(H1) U3.80(H10) U3.81(J1) U3.90(J10) U3.91(K1) U3.100(K10) U3.101(L1) U3.110(L10) U3.111(M1) U3.120(M10) U3.121(N1) U3.130(N10) U3.131(P1) U3.140(P10) U3.141(R1) U3.150(R10) U3.151(S1) U3.160(S10) U3.161(T1) U3.170(T10) U3.171(U1) U3.180(U10) U3.181(V1) U3.190(V10) U3.191(W1) U3.200(W10) U3.201(X1) U3.210(X10) U3.211(Y1) U3.220(Y10) U3.221(Z1) U3.230(Z10) U3.231(AA1) U3.240(AA10) U3.241(BB1) U3.250(BB10) U3.251(CC1) U3.252(CC2) U3.253(CC3) U3.258(CC8) U3.259(CC9) U3.260(CC10) U4.1(A1) U4.2(A2) U4.8(A8) U4.9(A9) U4.10(A10) U4.11(B1) U4.20(B10) U4.21(C1) U4.30(C10) U4.31(D1) U4.40(D10) U4.41(E1) U4.50(E10) U4.51(F1) U4.60(F10) U4.61(G1) U4.70(G10) U4.71(H1) U4.80(H10) U4.81(J1) U4.90(J10) U4.91(K1) U4.100(K10) U4.101(L1) U4.110(L10) U4.111(M1) U4.120(M10) U4.121(N1) U4.130(N10) U4.131(P1) U4.140(P10) U4.141(R1) U4.150(R10) U4.151(S1) U4.160(S10) U4.161(T1) U4.170(T10) U4.171(U1) U4.180(U10) U4.181(V1) U4.190(V10) U4.191(W1) U4.200(W10) U4.201(X1) U4.210(X10) U4.211(Y1) U4.220(Y10) U4.221(Z1) U4.230(Z10) U4.231(AA1) U4.240(AA10) U4.241(BB1) U4.250(BB10) U4.251(CC1) U4.252(CC2) U4.253(CC3) U4.258(CC8) U4.259(CC9) U4.260(CC10)
DGND: J1.1 J1.2 J1.3 J1.4 J1.5 U5.9(GND)
VCC: K1.1 K1.4(8) K1.7(13) K34.1 K34.4(8) K34.7(13) K67.1 K67.4(8) K67.7(13) K100.1 K100.4(8) K100.7(13) K133.1 K133.4(8) K133.7(13) K166.1 K166.4(8) K166.7(13) U5.10(CD+)
IO1: K2.7 K68.7 K134.7 U1.175(U5)
IO2: K2.2 K68.2 K134.2 U1.174(U4)
IO3: K3.7 K69.7 K135.7 U1.173(U3)
IO4: K3.2 K69.2 K135.2 U1.172(U2)
IO5: K4.7 K70.7 K136.7 U1.182(V2)
IO6: K4.2 K70.2 K136.2 U1.183(V3)
IO7: K5.7 K71.7 K137.7 U1.184(V4)
IO8: K5.2 K71.2 K137.2 U1.185(V5)
IO9: K6.7 K72.7 K138.7 U1.195(W5)
IO10: K6.2 K72.2 K138.2 U1.194(W4)
IO11: K7.7 K73.7 K139.7 U1.193(W3)
IO12: K7.2 K73.2 K139.2 U1.192(W2)
IO13: K8.7 K74.7 K140.7 U1.202(X2)
IO14: K8.2 K74.2 K140.2 U1.203(X3)
IO15: K9.7 K75.7 K141.7 U1.204(X4)
IO16: K9.2 K75.2 K141.2 U1.205(X5)
IO17: K10.7 K76.7 K142.7 U1.215(Y5)
IO18: K10.2 K76.2 K142.2 U1.214(Y4)
IO19: K11.7 K77.7 K143.7 U1.213(Y3)
IO20: K11.2 K77.2 K143.2 U1.212(Y2)
IO21: K12.7 K78.7 K144.7 U1.222(Z2)
IO22: K12.2 K78.2 K144.2 U1.223(Z3)
IO23: K13.7 K79.7 K145.7 U1.224(Z4)
IO24: K13.2 K79.2 K145.2 U1.225(Z5)
IO25: K14.7 K80.7 K146.7 U1.235(AA5)
IO26: K14.2 K80.2 K146.2 U1.234(AA4)
IO27: K15.7 K81.7 K147.7 U1.233(AA3)
IO28: K15.2 K81.2 K147.2 U1.232(AA2)
IO29: K16.7 K82.7 K148.7 U1.242(BB2)
IO30: K16.2 K82.2 K148.2 U1.243(BB3)
IO31: K17.7 K83.7 K149.7 U1.244(BB4)
IO32: K17.2 K83.2 K149.2 U1.245(BB5)
IO33: K18.7 K84.7 K150.7 U1.246(BB6)
IO34: K18.2 K84.2 K150.2 U1.247(BB7)
IO35: K19.7 K85.7 K151.7 U1.248(BB8)
IO36: K19.2 K85.2 K151.2 U1.249(BB9)
IO37: K20.7 K86.7 K152.7 U1.239(AA9)
IO38: K20.2 K86.2 K152.2 U1.238(AA8)
IO39: K21.7 K87.7 K153.7 U1.237(AA7)
IO40: K21.2 K87.2 K153.2 U1.236(AA6)
IO41: K22.7 K88.7 K154.7 U1.226(Z6)
IO42: K22.2 K88.2 K154.2 U1.227(Z7)
IO43: K23.7 K89.7 K155.7 U1.228(Z8)
IO44: K23.2 K89.2 K155.2 U1.229(Z9)
IO45: K24.7 K90.7 K156.7 U1.219(Y9)
IO46: K24.2 K90.2 K156.2 U1.218(Y8)
IO47: K25.7 K91.7 K157.7 U1.217(Y7)
IO48: K25.2 K91.2 K157.2 U1.216(Y6)
IO49: K26.7 K92.7 K158.7 U1.206(X6)
IO50: K26.2 K92.2 K158.2 U1.207(X7)
IO51: K27.7 K93.7 K159.7 U1.208(X8)
IO52: K27.2 K93.2 K159.2 U1.209(X9)
IO53: K28.7 K94.7 K160.7 U1.199(W9)
IO54: K28.2 K94.2 K160.2 U1.198(W8)
IO55: K29.7 K95.7 K161.7 U1.197(W7)
IO56: K29.2 K95.2 K161.2 U1.196(W6)
IO57: K30.7 K96.7 K162.7 U1.186(V6)
IO58: K30.2 K96.2 K162.2 U1.187(V7)
IO59: K31.7 K97.7 K163.7 U1.188(V8)
IO60: K31.2 K97.2 K163.2 U1.189(V9)
IO61: K32.7 K98.7 K164.7 U1.179(U9)
IO62: K32.2 K98.2 K164.2 U1.178(U8)
IO63: K33.7 K99.7 K165.7 U1.177(U7)
IO64: K33.2 K99.2 K165.2 U1.176(U6)
IO65: K35.7 K101.7 K167.7 U1.165(T5)
IO66: K35.2 K101.2 K167.2 U1.164(T4)
IO67: K36.7 K102.7 K168.7 U1.163(T3)
IO68: K36.2 K102.2 K168.2 U1.162(T2)
IO69: K37.7 K103.7 K169.7 U1.152(S2)
IO70: K37.2 K103.2 K169.2 U1.153(S3)
IO71: K38.7 K104.7 K170.7 U1.154(S4)
IO72: K38.2 K104.2 K170.2 U1.155(S5)
IO73: K39.7 K105.7 K171.7 U1.145(R5)
IO74: K39.2 K105.2 K171.2 U1.144(R4)
IO75: K40.7 K106.7 K172.7 U1.143(R3)
IO76: K40.2 K106.2 K172.2 U1.142(R2)
IO77: K41.7 K107.7 K173.7 U1.132(P2)
IO78: K41.2 K107.2 K173.2 U1.133(P3)
IO79: K42.7 K108.7 K174.7 U1.134(P4)
IO80: K42.2 K108.2 K174.2 U1.135(P5)
IO81: K43.7 K109.7 K175.7 U1.125(N5)
IO82: K43.2 K109.2 K175.2 U1.124(N4)
IO83: K44.7 K110.7 K176.7 U1.123(N3)
IO84: K44.2 K110.2 K176.2 U1.122(N2)
IO85: K45.7 K111.7 K177.7 U1.112(M2)
IO86: K45.2 K111.2 K177.2 U1.113(M3)
IO87: K46.7 K112.7 K178.7 U1.114(M4)
IO88: K46.2 K112.2 K178.2 U1.115(M5)
IO89: K47.7 K113.7 K179.7 U1.105(L5)
IO90: K47.2 K113.2 K179.2 U1.104(L4)
IO91: K48.7 K114.7 K180.7 U1.103(L3)
IO92: K48.2 K114.2 K180.2 U1.102(L2)
IO93: K49.7 K115.7 K181.7 U1.92(K2)
IO94: K49.2 K115.2 K181.2 U1.93(K3)
IO95: K50.7 K116.7 K182.7 U1.94(K4)
IO96: K50.2 K116.2 K182.2 U1.95(K5)
IO97: K51.7 K117.7 K183.7 U1.96(K6)
IO98: K51.2 K117.2 K183.2 U1.97(K7)
IO99: K52.7 K118.7 K184.7 U1.98(K8)
IO100: K52.2 K118.2 K184.2 U1.99(K9)
IO101: K53.7 K119.7 K185.7 U1.109(L9)
IO102: K53.2 K119.2 K185.2 U1.108(L8)
IO103: K54.7 K120.7 K186.7 U1.107(L7)
IO104: K54.2 K120.2 K186.2 U1.106(L6)
IO105: K55.7 K121.7 K187.7 U1.116(M6)
IO106: K55.2 K121.2 K187.2 U1.117(M7)
IO107: K56.7 K122.7 K188.7 U1.118(M8)
IO108: K56.2 K122.2 K188.2 U1.119(M9)
IO109: K57.7 K123.7 K189.7 U1.129(N9)
IO110: K57.2 K123.2 K189.2 U1.128(N8)
IO111: K58.7 K124.7 K190.7 U1.127(N7)
IO112: K58.2 K124.2 K190.2 U1.126(N6)
IO113: K59.7 K125.7 K191.7 U1.136(P6)
IO114: K59.2 K125.2 K191.2 U1.137(P7)
IO115: K60.7 K126.7 K192.7 U1.138(P8)
IO116: K60.2 K126.2 K192.2 U1.139(P9)
IO117: K61.7 K127.7 K193.7 U1.149(R9)
IO118: K61.2 K127.2 K193.2 U1.148(R8)
IO119: K62.7 K128.7 K194.7 U1.147(R7)
IO120: K62.2 K128.2 K194.2 U1.146(R6)
IO121: K63.7 K129.7 K195.7 U1.156(S6)
IO122: K63.2 K129.2 K195.2 U1.157(S7)
IO123: K64.7 K130.7 K196.7 U1.158(S8)
IO124: K64.2 K130.2 K196.2 U1.159(S9)
IO125: K65.7 K131.7 K197.7 U1.169(T9)
IO126: K65.2 K131.2 K197.2 U1.168(T8)
IO127: K66.7 K132.7 K198.7 U1.167(T7)
IO128: K66.2 K132.2 K198.2 U1.166(T6)
SH1IO1: K2.5 U2.175(U5)
SH1IO2: K2.4 U2.174(U4)
SH1IO3: K3.5 U2.173(U3)
SH1IO4: K3.4 U2.172(U2)
SH1IO5: K4.5 U2.182(V2)
SH1IO6: K4.4 U2.183(V3)
SH1IO7: K5.5 U2.184(V4)
SH1IO8: K5.4 U2.185(V5)
SH1IO9: K6.5 U2.195(W5)
SH1IO10: K6.4 U2.194(W4)
SH1IO11: K7.5 U2.193(W3)
SH1IO12: K7.4 U2.192(W2)
SH1IO13: K8.5 U2.202(X2)
SH1IO14: K8.4 U2.203(X3)
SH1IO15: K9.5 U2.204(X4)
SH1IO16: K9.4 U2.205(X5)
SH1IO17: K10.5 U2.215(Y5)
SH1IO18: K10.4 U2.214(Y4)
SH1IO19: K11.5 U2.213(Y3)
SH1IO20: K11.4 U2.212(Y2)
SH1IO21: K12.5 U2.222(Z2)
SH1IO22: K12.4 U2.223(Z3)
SH1IO23: K13.5 U2.224(Z4)
SH1IO24: K13.4 U2.225(Z5)
SH1IO25: K14.5 U2.235(AA5)
SH1IO26: K14.4 U2.234(AA4)
SH1IO27: K15.5 U2.233(AA3)
SH1IO28: K15.4 U2.232(AA2)
SH1IO29: K16.5 U2.242(BB2)
SH1IO30: K16.4 U2.243(BB3)
SH1IO31: K17.5 U2.244(BB4)
SH1IO32: K17.4 U2.245(BB5)
SH1IO33: K18.5 U2.246(BB6)
SH1IO34: K18.4 U2.247(BB7)
SH1IO35: K19.5 U2.248(BB8)
SH1IO36: K19.4 U2.249(BB9)
SH1IO37: K20.5 U2.239(AA9)
SH1IO38: K20.4 U2.238(AA8)
SH1IO39: K21.5 U2.237(AA7)
SH1IO40: K21.4 U2.236(AA6)
SH1IO41: K22.5 U2.226(Z6)
SH1IO42: K22.4 U2.227(Z7)
SH1IO43: K23.5 U2.228(Z8)
SH1IO44: K23.4 U2.229(Z9)
SH1IO45: K24.5 U2.219(Y9)
SH1IO46: K24.4 U2.218(Y8)
SH1IO47: K25.5 U2.217(Y7)
SH1IO48: K25.4 U2.216(Y6)
SH1IO49: K26.5 U2.206(X6)
SH1IO50: K26.4 U2.207(X7)
SH1IO51: K27.5 U2.208(X8)
SH1IO52: K27.4 U2.209(X9)
SH1IO53: K28.5 U2.199(W9)
SH1IO54: K28.4 U2.198(W8)
SH1IO55: K29.5 U2.197(W7)
SH1IO56: K29.4 U2.196(W6)
SH1IO57: K30.5 U2.186(V6)
SH1IO58: K30.4 U2.187(V7)
SH1IO59: K31.5 U2.188(V8)
SH1IO60: K31.4 U2.189(V9)
SH1IO61: K32.5 U2.179(U9)
SH1IO62: K32.4 U2.178(U8)
SH1IO63: K33.5 U2.177(U7)
SH1IO64: K33.4 U2.176(U6)
SH1IO65: K35.5 U2.165(T5)
SH1IO66: K35.4 U2.164(T4)
SH1IO67: K36.5 U2.163(T3)
SH1IO68: K36.4 U2.162(T2)
SH1IO69: K37.5 U2.152(S2)
SH1IO70: K37.4 U2.153(S3)
SH1IO71: K38.5 U2.154(S4)
SH1IO72: K38.4 U2.155(S5)
SH1IO73: K39.5 U2.145(R5)
SH1IO74: K39.4 U2.144(R4)
SH1IO75: K40.5 U2.143(R3)
SH1IO76: K40.4 U2.142(R2)
SH1IO77: K41.5 U2.132(P2)
SH1IO78: K41.4 U2.133(P3)
SH1IO79: K42.5 U2.134(P4)
SH1IO80: K42.4 U2.135(P5)
SH1IO81: K43.5 U2.125(N5)
SH1IO82: K43.4 U2.124(N4)
SH1IO83: K44.5 U2.123(N3)
SH1IO84: K44.4 U2.122(N2)
SH1IO85: K45.5 U2.112(M2)
SH1IO86: K45.4 U2.113(M3)
SH1IO87: K46.5 U2.114(M4)
SH1IO88: K46.4 U2.115(M5)
SH1IO89: K47.5 U2.105(L5)
SH1IO90: K47.4 U2.104(L4)
SH1IO91: K48.5 U2.103(L3)
SH1IO92: K48.4 U2.102(L2)
SH1IO93: K49.5 U2.92(K2)
SH1IO94: K49.4 U2.93(K3)
SH1IO95: K50.5 U2.94(K4)
SH1IO96: K50.4 U2.95(K5)
SH1IO97: K51.5 U2.96(K6)
SH1IO98: K51.4 U2.97(K7)
SH1IO99: K52.5 U2.98(K8)
SH1IO100: K52.4 U2.99(K9)
SH1IO101: K53.5 U2.109(L9)
SH1IO102: K53.4 U2.108(L8)
SH1IO103: K54.5 U2.107(L7)
SH1IO104: K54.4 U2.106(L6)
SH1IO105: K55.5 U2.116(M6)
SH1IO106: K55.4 U2.117(M7)
SH1IO107: K56.5 U2.118(M8)
SH1IO108: K56.4 U2.119(M9)
SH1IO109: K57.5 U2.129(N9)
SH1IO110: K57.4 U2.128(N8)
SH1IO111: K58.5 U2.127(N7)
SH1IO112: K58.4 U2.126(N6)
SH1IO113: K59.5 U2.136(P6)
SH1IO114: K59.4 U2.137(P7)
SH1IO115: K60.5 U2.138(P8)
SH1IO116: K60.4 U2.139(P9)
SH1IO117: K61.5 U2.149(R9)
SH1IO118: K61.4 U2.148(R8)
SH1IO119: K62.5 U2.147(R7)
SH1IO120: K62.4 U2.146(R6)
SH1IO121: K63.5 U2.156(S6)
SH1IO122: K63.4 U2.157(S7)
SH1IO123: K64.5 U2.158(S8)
SH1IO124: K64.4 U2.159(S9)
SH1IO125: K65.5 U2.169(T9)
SH1IO126: K65.4 U2.168(T8)
SH1IO127: K66.5 U2.167(T7)
SH1IO128: K66.4 U2.166(T6)
SH1SELECT: J2.4 U5.7(I7) U5.8(I8)
SH2IO1: K68.5 U3.175(U5)
SH2IO2: K68.4 U3.174(U4)
SH2IO3: K69.5 U3.173(U3)
SH2IO4: K69.4 U3.172(U2)
SH2IO5: K70.5 U3.182(V2)
SH2IO6: K70.4 U3.183(V3)
SH2IO7: K71.5 U3.184(V4)
SH2IO8: K71.4 U3.185(V5)
SH2IO9: K72.5 U3.195(W5)
SH2IO10: K72.4 U3.194(W4)
SH2IO11: K73.5 U3.193(W3)
SH2IO12: K73.4 U3.192(W2)
SH2IO13: K74.5 U3.202(X2)
SH2IO14: K74.4 U3.203(X3)
SH2IO15: K75.5 U3.204(X4)
SH2IO16: K75.4 U3.205(X5)
SH2IO17: K76.5 U3.215(Y5)
SH2IO18: K76.4 U3.214(Y4)
SH2IO19: K77.5 U3.213(Y3)
SH2IO20: K77.4 U3.212(Y2)
SH2IO21: K78.5 U3.222(Z2)
SH2IO22: K78.4 U3.223(Z3)
SH2IO23: K79.5 U3.224(Z4)
SH2IO24: K79.4 U3.225(Z5)
SH2IO25: K80.5 U3.235(AA5)
SH2IO26: K80.4 U3.234(AA4)
SH2IO27: K81.5 U3.233(AA3)
SH2IO28: K81.4 U3.232(AA2)
SH2IO29: K82.5 U3.242(BB2)
SH2IO30: K82.4 U3.243(BB3)
SH2IO31: K83.5 U3.244(BB4)
SH2IO32: K83.4 U3.245(BB5)
SH2IO33: K84.5 U3.246(BB6)
SH2IO34: K84.4 U3.247(BB7)
SH2IO35: K85.5 U3.248(BB8)
SH2IO36: K85.4 U3.249(BB9)
SH2IO37: K86.5 U3.239(AA9)
SH2IO38: K86.4 U3.238(AA8)
SH2IO39: K87.5 U3.237(AA7)
SH2IO40: K87.4 U3.236(AA6)
SH2IO41: K88.5 U3.226(Z6)
SH2IO42: K88.4 U3.227(Z7)
SH2IO43: K89.5 U3.228(Z8)
SH2IO44: K89.4 U3.229(Z9)
SH2IO45: K90.5 U3.219(Y9)
SH2IO46: K90.4 U3.218(Y8)
SH2IO47: K91.5 U3.217(Y7)
SH2IO48: K91.4 U3.216(Y6)
SH2IO49: K92.5 U3.206(X6)
SH2IO50: K92.4 U3.207(X7)
SH2IO51: K93.5 U3.208(X8)
SH2IO52: K93.4 U3.209(X9)
SH2IO53: K94.5 U3.199(W9)
SH2IO54: K94.4 U3.198(W8)
SH2IO55: K95.5 U3.197(W7)
SH2IO56: K95.4 U3.196(W6)
SH2IO57: K96.5 U3.186(V6)
SH2IO58: K96.4 U3.187(V7)
SH2IO59: K97.5 U3.188(V8)
SH2IO60: K97.4 U3.189(V9)
SH2IO61: K98.5 U3.179(U9)
SH2IO62: K98.4 U3.178(U8)
SH2IO63: K99.5 U3.177(U7)
SH2IO64: K99.4 U3.176(U6)
SH2IO65: K101.5 U3.165(T5)
SH2IO66: K101.4 U3.164(T4)
SH2IO67: K102.5 U3.163(T3)
SH2IO68: K102.4 U3.162(T2)
SH2IO69: K103.5 U3.152(S2)
SH2IO70: K103.4 U3.153(S3)
SH2IO71: K104.5 U3.154(S4)
SH2IO72: K104.4 U3.155(S5)
SH2IO73: K105.5 U3.145(R5)
SH2IO74: K105.4 U3.144(R4)
SH2IO75: K106.5 U3.143(R3)
SH2IO76: K106.4 U3.142(R2)
SH2IO77: K107.5 U3.132(P2)
SH2IO78: K107.4 U3.133(P3)
SH2IO79: K108.5 U3.134(P4)
SH2IO80: K108.4 U3.135(P5)
SH2IO81: K109.5 U3.125(N5)
SH2IO82: K109.4 U3.124(N4)
SH2IO83: K110.5 U3.123(N3)
SH2IO84: K110.4 U3.122(N2)
SH2IO85: K111.5 U3.112(M2)
SH2IO86: K111.4 U3.113(M3)
SH2IO87: K112.5 U3.114(M4)
SH2IO88: K112.4 U3.115(M5)
SH2IO89: K113.5 U3.105(L5)
SH2IO90: K113.4 U3.104(L4)
SH2IO91: K114.5 U3.103(L3)
SH2IO92: K114.4 U3.102(L2)
SH2IO93: K115.5 U3.92(K2)
SH2IO94: K115.4 U3.93(K3)
SH2IO95: K116.5 U3.94(K4)
SH2IO96: K116.4 U3.95(K5)
SH2IO97: K117.5 U3.96(K6)
SH2IO98: K117.4 U3.97(K7)
SH2IO99: K118.5 U3.98(K8)
SH2IO100: K118.4 U3.99(K9)
SH2IO101: K119.5 U3.109(L9)
SH2IO102: K119.4 U3.108(L8)
SH2IO103: K120.5 U3.107(L7)
SH2IO104: K120.4 U3.106(L6)
SH2IO105: K121.5 U3.116(M6)
SH2IO106: K121.4 U3.117(M7)
SH2IO107: K122.5 U3.118(M8)
SH2IO108: K122.4 U3.119(M9)
SH2IO109: K123.5 U3.129(N9)
SH2IO110: K123.4 U3.128(N8)
SH2IO111: K124.5 U3.127(N7)
SH2IO112: K124.4 U3.126(N6)
SH2IO113: K125.5 U3.136(P6)
SH2IO114: K125.4 U3.137(P7)
SH2IO115: K126.5 U3.138(P8)
SH2IO116: K126.4 U3.139(P9)
SH2IO117: K127.5 U3.149(R9)
SH2IO118: K127.4 U3.148(R8)
SH2IO119: K128.5 U3.147(R7)
SH2IO120: K128.4 U3.146(R6)
SH2IO121: K129.5 U3.156(S6)
SH2IO122: K129.4 U3.157(S7)
SH2IO123: K130.5 U3.158(S8)
SH2IO124: K130.4 U3.159(S9)
SH2IO125: K131.5 U3.169(T9)
SH2IO126: K131.4 U3.168(T8)
SH2IO127: K132.5 U3.167(T7)
SH2IO128: K132.4 U3.166(T6)
SH2IP67: K67.8(16) U5.13(O6)
SH2IP100: K100.8(16) U5.14(O5)
SH2SELECT: J2.3 U5.5(I5) U5.6(I6)
SH3IO1: K134.5 U4.175(U5)
SH3IO2: K134.4 U4.174(U4)
SH3IO3: K135.5 U4.173(U3)
SH3IO4: K135.4 U4.172(U2)
SH3IO5: K136.5 U4.182(V2)
SH3IO6: K136.4 U4.183(V3)
SH3IO7: K137.5 U4.184(V4)
SH3IO8: K137.4 U4.185(V5)
SH3IO9: K138.5 U4.195(W5)
SH3IO10: K138.4 U4.194(W4)
SH3IO11: K139.5 U4.193(W3)
SH3IO12: K139.4 U4.192(W2)
SH3IO13: K140.5 U4.202(X2)
SH3IO14: K140.4 U4.203(X3)
SH3IO15: K141.5 U4.204(X4)
SH3IO16: K141.4 U4.205(X5)
SH3IO17: K142.5 U4.215(Y5)
SH3IO18: K142.4 U4.214(Y4)
SH3IO19: K143.5 U4.213(Y3)
SH3IO20: K143.4 U4.212(Y2)
SH3IO21: K144.5 U4.222(Z2)
SH3IO22: K144.4 U4.223(Z3)
SH3IO23: K145.5 U4.224(Z4)
SH3IO24: K145.4 U4.225(Z5)
SH3IO25: K146.5 U4.235(AA5)
SH3IO26: K146.4 U4.234(AA4)
SH3IO27: K147.5 U4.233(AA3)
SH3IO28: K147.4 U4.232(AA2)
SH3IO29: K148.5 U4.242(BB2)
SH3IO30: K148.4 U4.243(BB3)
SH3IO31: K149.5 U4.244(BB4)
SH3IO32: K149.4 U4.245(BB5)
SH3IO33: K150.5 U4.246(BB6)
SH3IO34: K150.4 U4.247(BB7)
SH3IO35: K151.5 U4.248(BB8)
SH3IO36: K151.4 U4.249(BB9)
SH3IO37: K152.5 U4.239(AA9)
SH3IO38: K152.4 U4.238(AA8)
SH3IO39: K153.5 U4.237(AA7)
SH3IO40: K153.4 U4.236(AA6)
SH3IO41: K154.5 U4.226(Z6)
SH3IO42: K154.4 U4.227(Z7)
SH3IO43: K155.5 U4.228(Z8)
SH3IO44: K155.4 U4.229(Z9)
SH3IO45: K156.5 U4.219(Y9)
SH3IO46: K156.4 U4.218(Y8)
SH3IO47: K157.5 U4.217(Y7)
SH3IO48: K157.4 U4.216(Y6)
SH3IO49: K158.5 U4.206(X6)
SH3IO50: K158.4 U4.207(X7)
SH3IO51: K159.5 U4.208(X8)
SH3IO52: K159.4 U4.209(X9)
SH3IO53: K160.5 U4.199(W9)
SH3IO54: K160.4 U4.198(W8)
SH3IO55: K161.5 U4.197(W7)
SH3IO56: K161.4 U4.196(W6)
SH3IO57: K162.5 U4.186(V6)
SH3IO58: K162.4 U4.187(V7)
SH3IO59: K163.5 U4.188(V8)
SH3IO60: K163.4 U4.189(V9)
SH3IO61: K164.5 U4.179(U9)
SH3IO62: K164.4 U4.178(U8)
SH3IO63: K165.5 U4.177(U7)
SH3IO64: K165.4 U4.176(U6)
SH3IO65: K167.5 U4.165(T5)
SH3IO66: K167.4 U4.164(T4)
SH3IO67: K168.5 U4.163(T3)
SH3IO68: K168.4 U4.162(T2)
SH3IO69: K169.5 U4.152(S2)
SH3IO70: K169.4 U4.153(S3)
SH3IO71: K170.5 U4.154(S4)
SH3IO72: K170.4 U4.155(S5)
SH3IO73: K171.5 U4.145(R5)
SH3IO74: K171.4 U4.144(R4)
SH3IO75: K172.5 U4.143(R3)
SH3IO76: K172.4 U4.142(R2)
SH3IO77: K173.5 U4.132(P2)
SH3IO78: K173.4 U4.133(P3)
SH3IO79: K174.5 U4.134(P4)
SH3IO80: K174.4 U4.135(P5)
SH3IO81: K175.5 U4.125(N5)
SH3IO82: K175.4 U4.124(N4)
SH3IO83: K176.5 U4.123(N3)
SH3IO84: K176.4 U4.122(N2)
SH3IO85: K177.5 U4.112(M2)
SH3IO86: K177.4 U4.113(M3)
SH3IO87: K178.5 U4.114(M4)
SH3IO88: K178.4 U4.115(M5)
SH3IO89: K179.5 U4.105(L5)
SH3IO90: K179.4 U4.104(L4)
SH3IO91: K180.5 U4.103(L3)
SH3IO92: K180.4 U4.102(L2)
SH3IO93: K181.5 U4.92(K2)
SH3IO94: K181.4 U4.93(K3)
SH3IO95: K182.5 U4.94(K4)
SH3IO96: K182.4 U4.95(K5)
SH3IO97: K183.5 U4.96(K6)
SH3IO98: K183.4 U4.97(K7)
SH3IO99: K184.5 U4.98(K8)
SH3IO100: K184.4 U4.99(K9)
SH3IO101: K185.5 U4.109(L9)
SH3IO102: K185.4 U4.108(L8)
SH3IO103: K186.5 U4.107(L7)
SH3IO104: K186.4 U4.106(L6)
SH3IO105: K187.5 U4.116(M6)
SH3IO106: K187.4 U4.117(M7)
SH3IO107: K188.5 U4.118(M8)
SH3IO108: K188.4 U4.119(M9)
SH3IO109: K189.5 U4.129(N9)
SH3IO110: K189.4 U4.128(N8)
SH3IO111: K190.5 U4.127(N7)
SH3IO112: K190.4 U4.126(N6)
SH3IO113: K191.5 U4.136(P6)
SH3IO114: K191.4 U4.137(P7)
SH3IO115: K192.5 U4.138(P8)
SH3IO116: K192.4 U4.139(P9)
SH3IO117: K193.5 U4.149(R9)
SH3IO118: K193.4 U4.148(R8)
SH3IO119: K194.5 U4.147(R7)
SH3IO120: K194.4 U4.146(R6)
SH3IO121: K195.5 U4.156(S6)
SH3IO122: K195.4 U4.157(S7)
SH3IO123: K196.5 U4.158(S8)
SH3IO124: K196.4 U4.159(S9)
SH3IO125: K197.5 U4.169(T9)
SH3IO126: K197.4 U4.168(T8)
SH3IO127: K198.5 U4.167(T7)
SH3IO128: K198.4 U4.166(T6)
SH3IP133: K133.8(16) U5.15(O4)
SH3IP166: K166.8(16) U5.16(O3)
SH3SELECT: J2.2 U5.3(I3) U5.4(I4)
Net-(K1-3): K1.3(6) K2.1 K3.1 K4.1 K5.1 K6.1 K7.1 K8.1 K9.1 K10.1 K11.1 K12.1 K13.1 K14.1 K15.1 K16.1 K17.1 K18.1 K19.1 K20.1 K21.1 K22.1 K23.1 K24.1 K25.1 K26.1 K27.1 K28.1 K29.1 K30.1 K31.1 K32.1 K33.1
Net-(K1-6): K1.6(11) K2.8 K3.8 K4.8 K5.8 K6.8 K7.8 K8.8 K9.8 K10.8 K11.8 K12.8 K13.8 K14.8 K15.8 K16.8 K17.8 K18.8 K19.8 K20.8 K21.8 K22.8 K23.8 K24.8 K25.8 K26.8 K27.8 K28.8 K29.8 K30.8 K31.8 K32.8 K33.8
Net-(K1-8): K1.8(16) U5.11(O8)
Net-(K34-3): K34.3(6) K35.1 K36.1 K37.1 K38.1 K39.1 K40.1 K41.1 K42.1 K43.1 K44.1 K45.1 K46.1 K47.1 K48.1 K49.1 K50.1 K51.1 K52.1 K53.1 K54.1 K55.1 K56.1 K57.1 K58.1 K59.1 K60.1 K61.1 K62.1 K63.1 K64.1 K65.1 K66.1
Net-(K34-6): K34.6(11) K35.8 K36.8 K37.8 K38.8 K39.8 K40.8 K41.8 K42.8 K43.8 K44.8 K45.8 K46.8 K47.8 K48.8 K49.8 K50.8 K51.8 K52.8 K53.8 K54.8 K55.8 K56.8 K57.8 K58.8 K59.8 K60.8 K61.8 K62.8 K63.8 K64.8 K65.8 K66.8
Net-(K34-8): K34.8(16) U5.12(O7)
Net-(K67-3): K67.3(6) K68.1 K69.1 K70.1 K71.1 K72.1 K73.1 K74.1 K75.1 K76.1 K77.1 K78.1 K79.1 K80.1 K81.1 K82.1 K83.1 K84.1 K85.1 K86.1 K87.1 K88.1 K89.1 K90.1 K91.1 K92.1 K93.1 K94.1 K95.1 K96.1 K97.1 K98.1 K99.1
Net-(K67-6): K67.6(11) K68.8 K69.8 K70.8 K71.8 K72.8 K73.8 K74.8 K75.8 K76.8 K77.8 K78.8 K79.8 K80.8 K81.8 K82.8 K83.8 K84.8 K85.8 K86.8 K87.8 K88.8 K89.8 K90.8 K91.8 K92.8 K93.8 K94.8 K95.8 K96.8 K97.8 K98.8 K99.8
Net-(K100-3): K100.3(6) K101.1 K102.1 K103.1 K104.1 K105.1 K106.1 K107.1 K108.1 K109.1 K110.1 K111.1 K112.1 K113.1 K114.1 K115.1 K116.1 K117.1 K118.1 K119.1 K120.1 K121.1 K122.1 K123.1 K124.1 K125.1 K126.1 K127.1 K128.1 K129.1 K130.1 K131.1 K132.1
Net-(K100-6): K100.6(11) K101.8 K102.8 K103.8 K104.8 K105.8 K106.8 K107.8 K108.8 K109.8 K110.8 K111.8 K112.8 K113.8 K114.8 K115.8 K116.8 K117.8 K118.8 K119.8 K120.8 K121.8 K122.8 K123.8 K124.8 K125.8 K126.8 K127.8 K128.8 K129.8 K130.8 K131.8 K132.8
Net-(K133-3): K133.3(6) K134.1 K135.1 K136.1 K137.1 K138.1 K139.1 K140.1 K141.1 K142.1 K143.1 K144.1 K145.1 K146.1 K147.1 K148.1 K149.1 K150.1 K151.1 K152.1 K153.1 K154.1 K155.1 K156.1 K157.1 K158.1 K159.1 K160.1 K161.1 K162.1 K163.1 K164.1 K165.1
Net-(K133-6): K133.6(11) K134.8 K135.8 K136.8 K137.8 K138.8 K139.8 K140.8 K141.8 K142.8 K143.8 K144.8 K145.8 K146.8 K147.8 K148.8 K149.8 K150.8 K151.8 K152.8 K153.8 K154.8 K155.8 K156.8 K157.8 K158.8 K159.8 K160.8 K161.8 K162.8 K163.8 K164.8 K165.8
Net-(K166-3): K166.3(6) K167.1 K168.1 K169.1 K170.1 K171.1 K172.1 K173.1 K174.1 K175.1 K176.1 K177.1 K178.1 K179.1 K180.1 K181.1 K182.1 K183.1 K184.1 K185.1 K186.1 K187.1 K188.1 K189.1 K190.1 K191.1 K192.1 K193.1 K194.1 K195.1 K196.1 K197.1 K198.1
Net-(K166-6): K166.6(11) K167.8 K168.8 K169.8 K170.8 K171.8 K172.8 K173.8 K174.8 K175.8 K176.8 K177.8 K178.8 K179.8 K180.8 K181.8 K182.8 K191.8 K192.8 K193.8 K194.8 K195.8 K196.8 K197.8 K198.8
Net-(K183-8): K183.8 K184.8 K185.8 K186.8 K187.8 K188.8 K189.8 K190.8

Not connected (* = marked no-connect by the designer): J2 1*; U1 3(A3)* 4(A4)* 5(A5)* 6(A6)* 7(A7)* 12(B2)* 13(B3)* 14(B4)* 15(B5)* 16(B6)* 17(B7)* 18(B8)* 19(B9)* 22(C2)* 23(C3)* 24(C4)* 25(C5)* 26(C6)* 27(C7)* 28(C8)* 29(C9)* 32(D2)* 33(D3)* 34(D4)* 35(D5)* 36(D6)* 37(D7)* 38(D8)* 39(D9)* 42(E2)* 43(E3)* 44(E4)* 45(E5)* 46(E6)* 47(E7)* 48(E8)* 49(E9)* 52(F2)* 53(F3)* 54(F4)* 55(F5)* 56(F6)* 57(F7)* 58(F8)* 59(F9)* 62(G2)* 63(G3)* 64(G4)* 65(G5)* 66(G6)* 67(G7)* 68(G8)* 69(G9)* 72(H2)* 73(H3)* 74(H4)* 75(H5)* 76(H6)* 77(H7)* 78(H8)* 79(H9)* 82(J2)* 83(J3)* 84(J4)* 85(J5)* 86(J6)* 87(J7)* 88(J8)* 89(J9)* 254(CC4)* 255(CC5)* 256(CC6)* 257(CC7)*; U2 3(A3)* 4(A4)* 5(A5)* 6(A6)* 7(A7)* 12(B2)* 13(B3)* 14(B4)* 15(B5)* 16(B6)* 17(B7)* 18(B8)* 19(B9)* 22(C2)* 23(C3)* 24(C4)* 25(C5)* 26(C6)* 27(C7)* 28(C8)* 29(C9)* 32(D2)* 33(D3)* 34(D4)* 35(D5)* 36(D6)* 37(D7)* 38(D8)* 39(D9)* 42(E2)* 43(E3)* 44(E4)* 45(E5)* 46(E6)* 47(E7)* 48(E8)* 49(E9)* 52(F2)* 53(F3)* 54(F4)* 55(F5)* 56(F6)* 57(F7)* 58(F8)* 59(F9)* 62(G2)* 63(G3)* 64(G4)* 65(G5)* 66(G6)* 67(G7)* 68(G8)* 69(G9)* 72(H2)* 73(H3)* 74(H4)* 75(H5)* 76(H6)* 77(H7)* 78(H8)* 79(H9)* 82(J2)* 83(J3)* 84(J4)* 85(J5)* 86(J6)* 87(J7)* 88(J8)* 89(J9)* 254(CC4)* 255(CC5)* 256(CC6)* 257(CC7)*; U3 3(A3)* 4(A4)* 5(A5)* 6(A6)* 7(A7)* 12(B2)* 13(B3)* 14(B4)* 15(B5)* 16(B6)* 17(B7)* 18(B8)* 19(B9)* 22(C2)* 23(C3)* 24(C4)* 25(C5)* 26(C6)* 27(C7)* 28(C8)* 29(C9)* 32(D2)* 33(D3)* 34(D4)* 35(D5)* 36(D6)* 37(D7)* 38(D8)* 39(D9)* 42(E2)* 43(E3)* 44(E4)* 45(E5)* 46(E6)* 47(E7)* 48(E8)* 49(E9)* 52(F2)* 53(F3)* 54(F4)* 55(F5)* 56(F6)* 57(F7)* 58(F8)* 59(F9)* 62(G2)* 63(G3)* 64(G4)* 65(G5)* 66(G6)* 67(G7)* 68(G8)* 69(G9)* 72(H2)* 73(H3)* 74(H4)* 75(H5)* 76(H6)* 77(H7)* 78(H8)* 79(H9)* 82(J2)* 83(J3)* 84(J4)* 85(J5)* 86(J6)* 87(J7)* 88(J8)* 89(J9)* 254(CC4)* 255(CC5)* 256(CC6)* 257(CC7)*; U4 3(A3)* 4(A4)* 5(A5)* 6(A6)* 7(A7)* 12(B2)* 13(B3)* 14(B4)* 15(B5)* 16(B6)* 17(B7)* 18(B8)* 19(B9)* 22(C2)* 23(C3)* 24(C4)* 25(C5)* 26(C6)* 27(C7)* 28(C8)* 29(C9)* 32(D2)* 33(D3)* 34(D4)* 35(D5)* 36(D6)* 37(D7)* 38(D8)* 39(D9)* 42(E2)* 43(E3)* 44(E4)* 45(E5)* 46(E6)* 47(E7)* 48(E8)* 49(E9)* 52(F2)* 53(F3)* 54(F4)* 55(F5)* 56(F6)* 57(F7)* 58(F8)* 59(F9)* 62(G2)* 63(G3)* 64(G4)* 65(G5)* 66(G6)* 67(G7)* 68(G8)* 69(G9)* 72(H2)* 73(H3)* 74(H4)* 75(H5)* 76(H6)* 77(H7)* 78(H8)* 79(H9)* 82(J2)* 83(J3)* 84(J4)* 85(J5)* 86(J6)* 87(J7)* 88(J8)* 89(J9)* 254(CC4)* 255(CC5)* 256(CC6)* 257(CC7)*; U5 1(I1)* 2(I2)* 17(O2)* 18(O1)*

## Notes on the sheets
sheet 2
- IM46TS
- IM46TS
- IM46TS
- IM46TS
- IM46TS
- IM46TS
- IM46TS
sheet 4
- IM46TS
- IM46TS
- IM46TS
- IM46TS
- IM46TS
- IM46TS
- IM46TS
